# EAGLE board RBCX-MainBoard (EAGLE 9.6.0), part 1 of 3
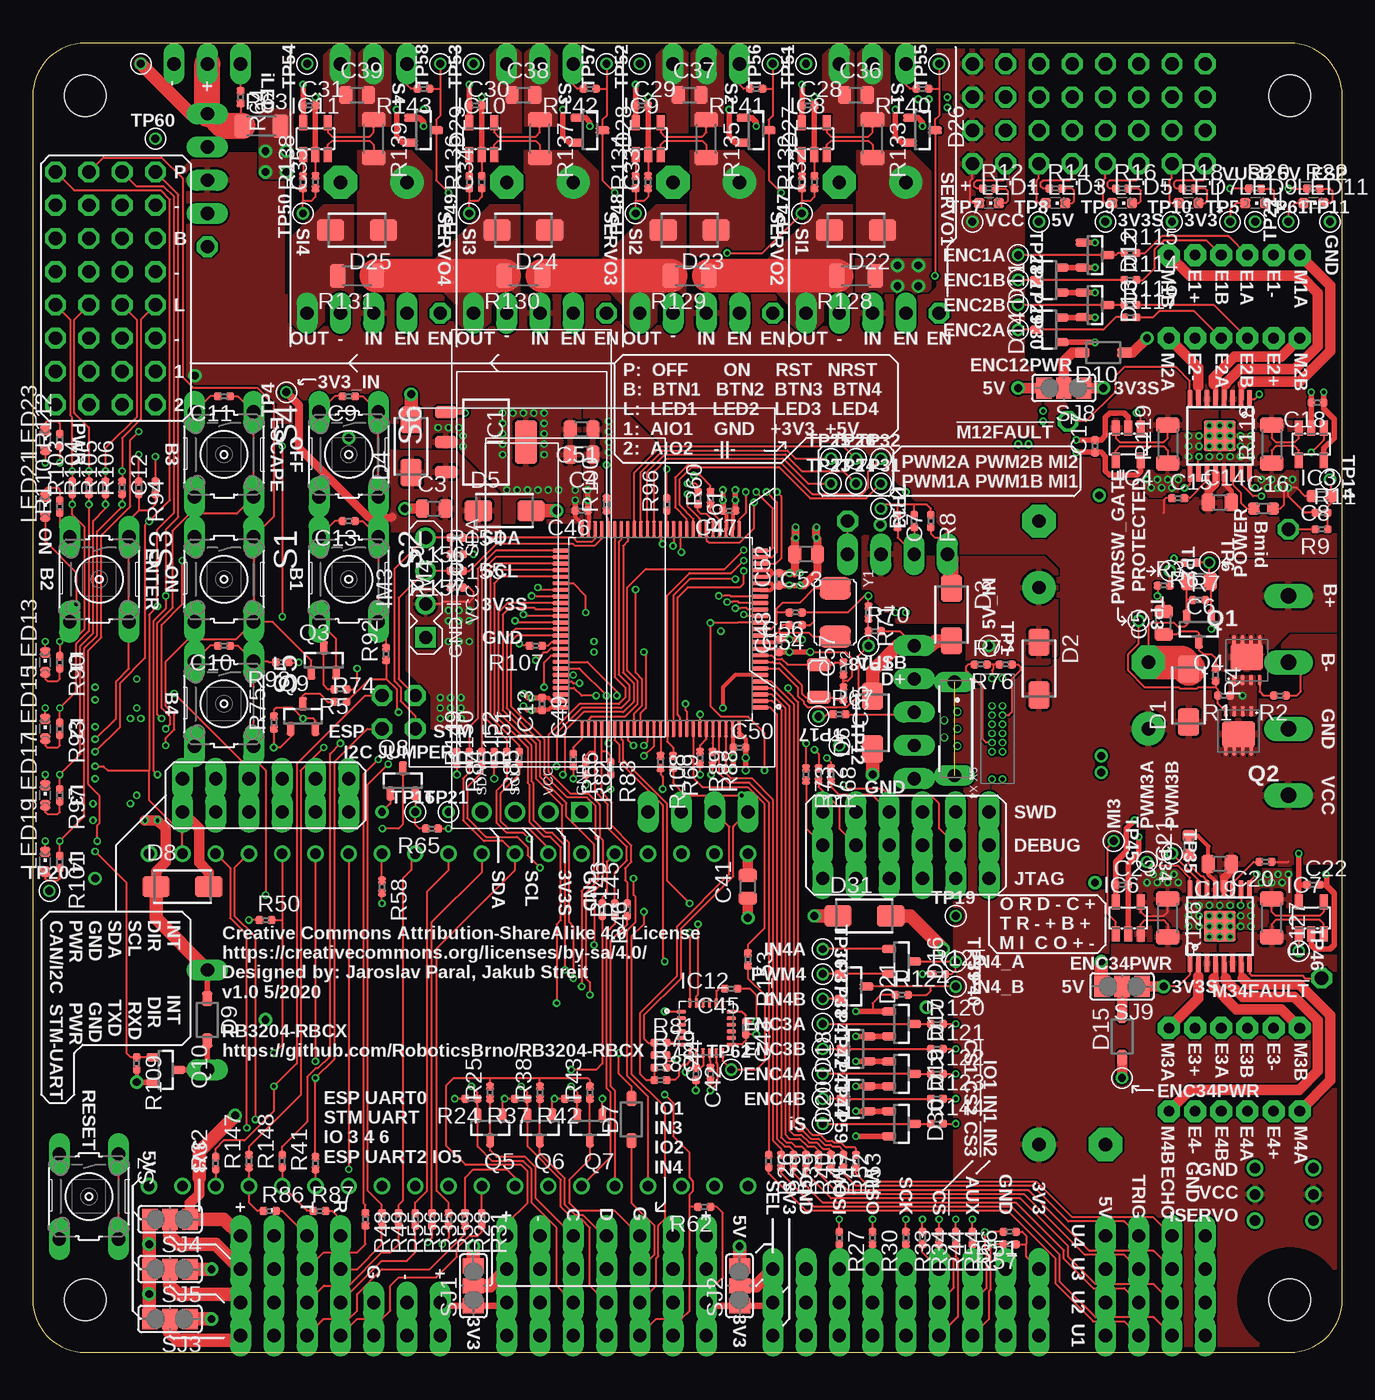
[diagram p14: board, top side]
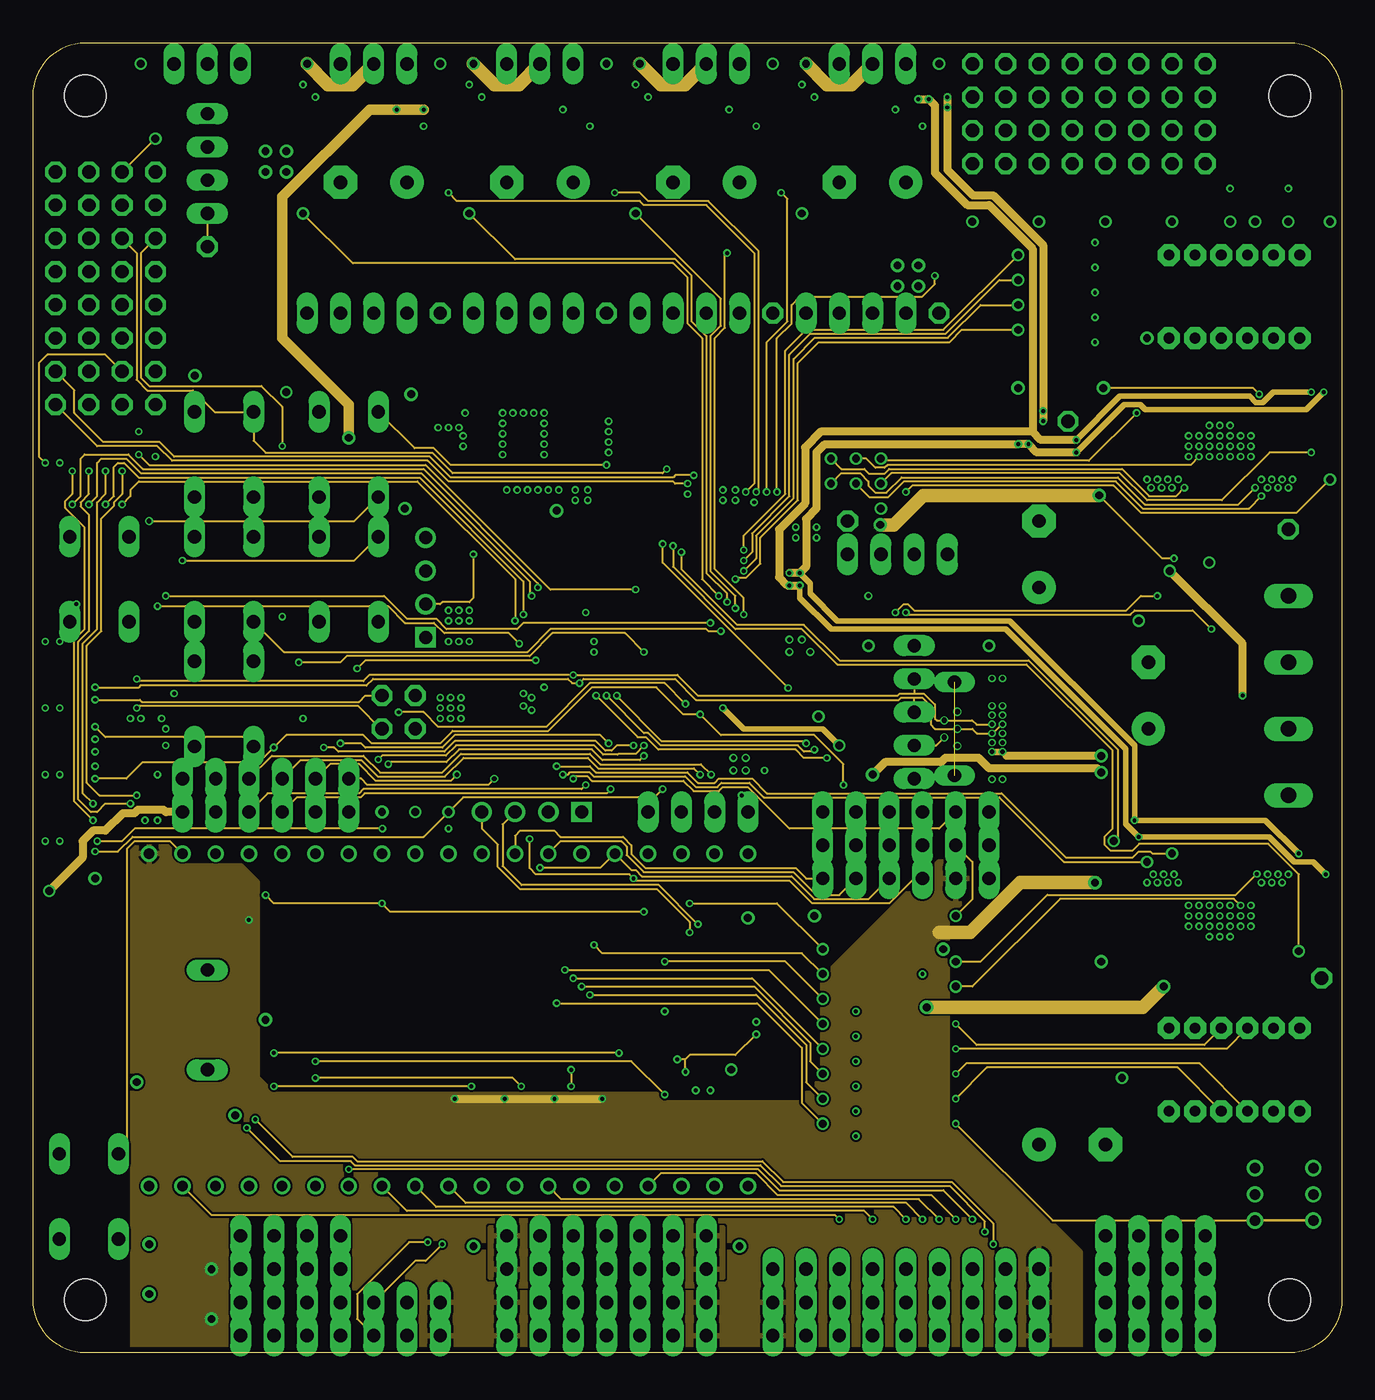
[diagram p15: board, inner layer Layer2-Sig]
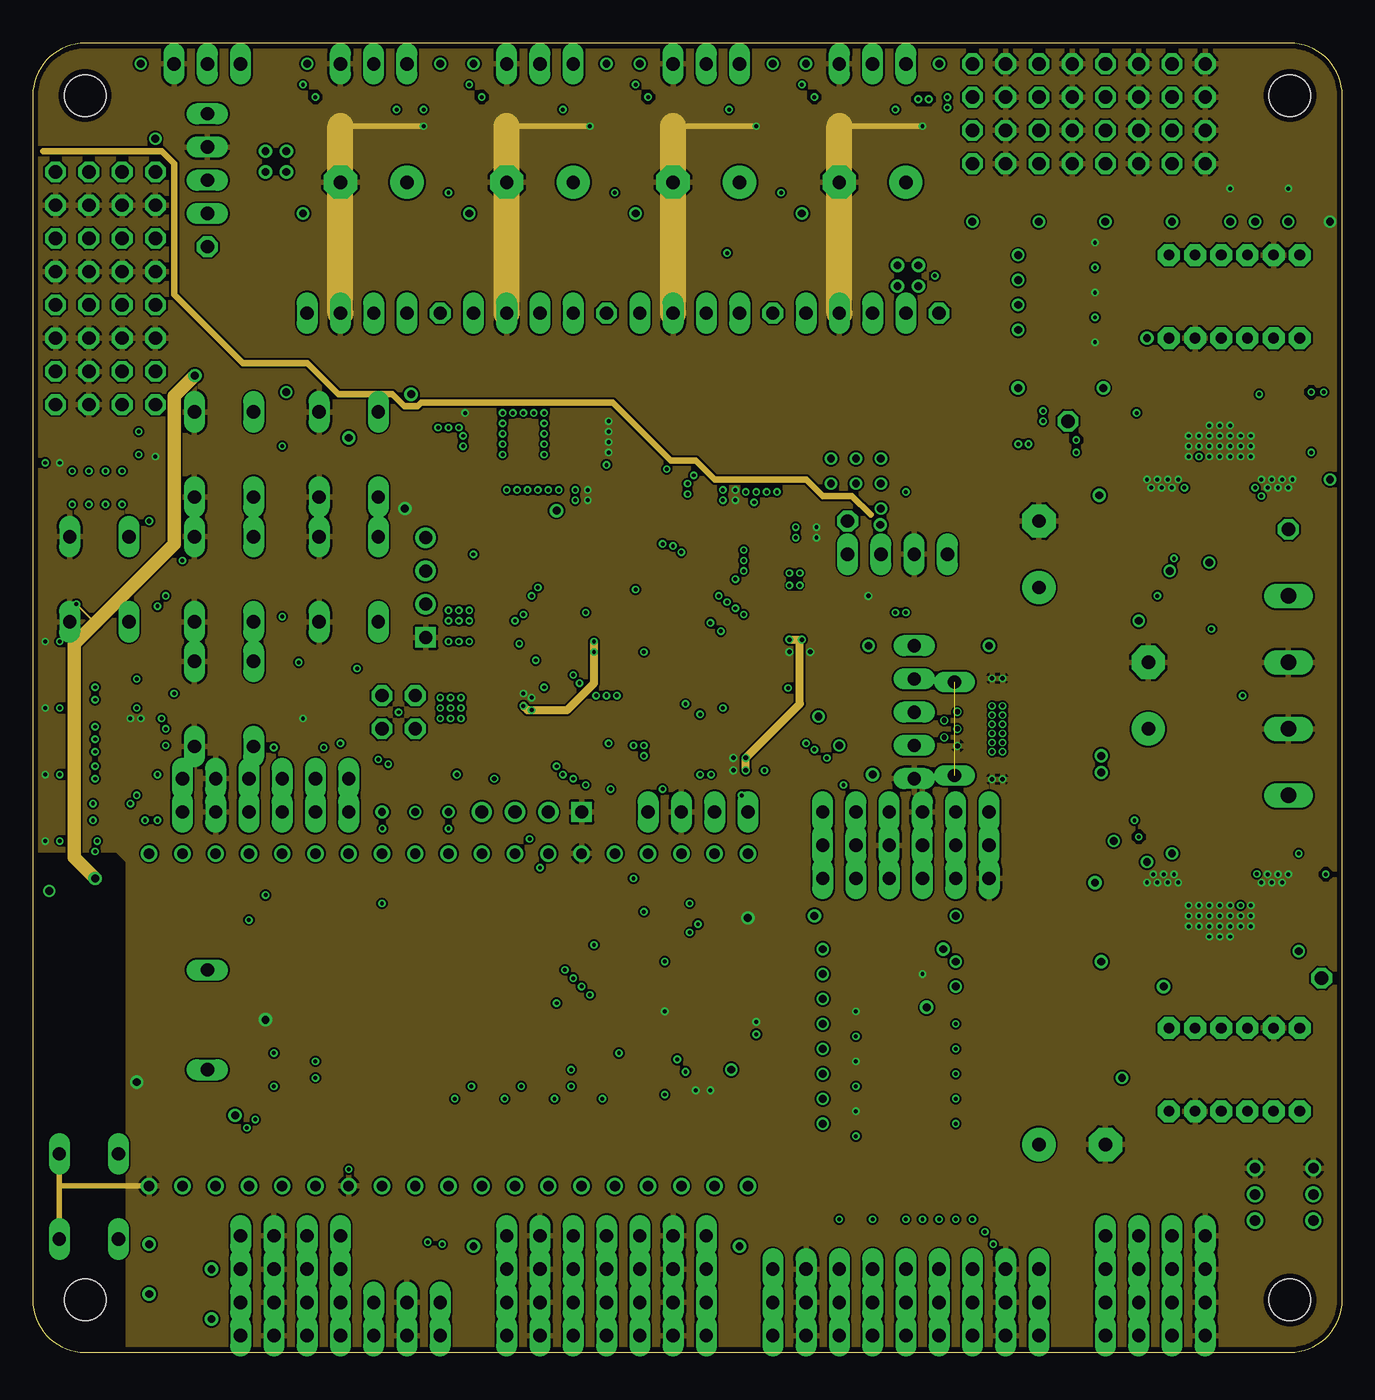
[diagram p16: board, inner layer Layer3-GND]
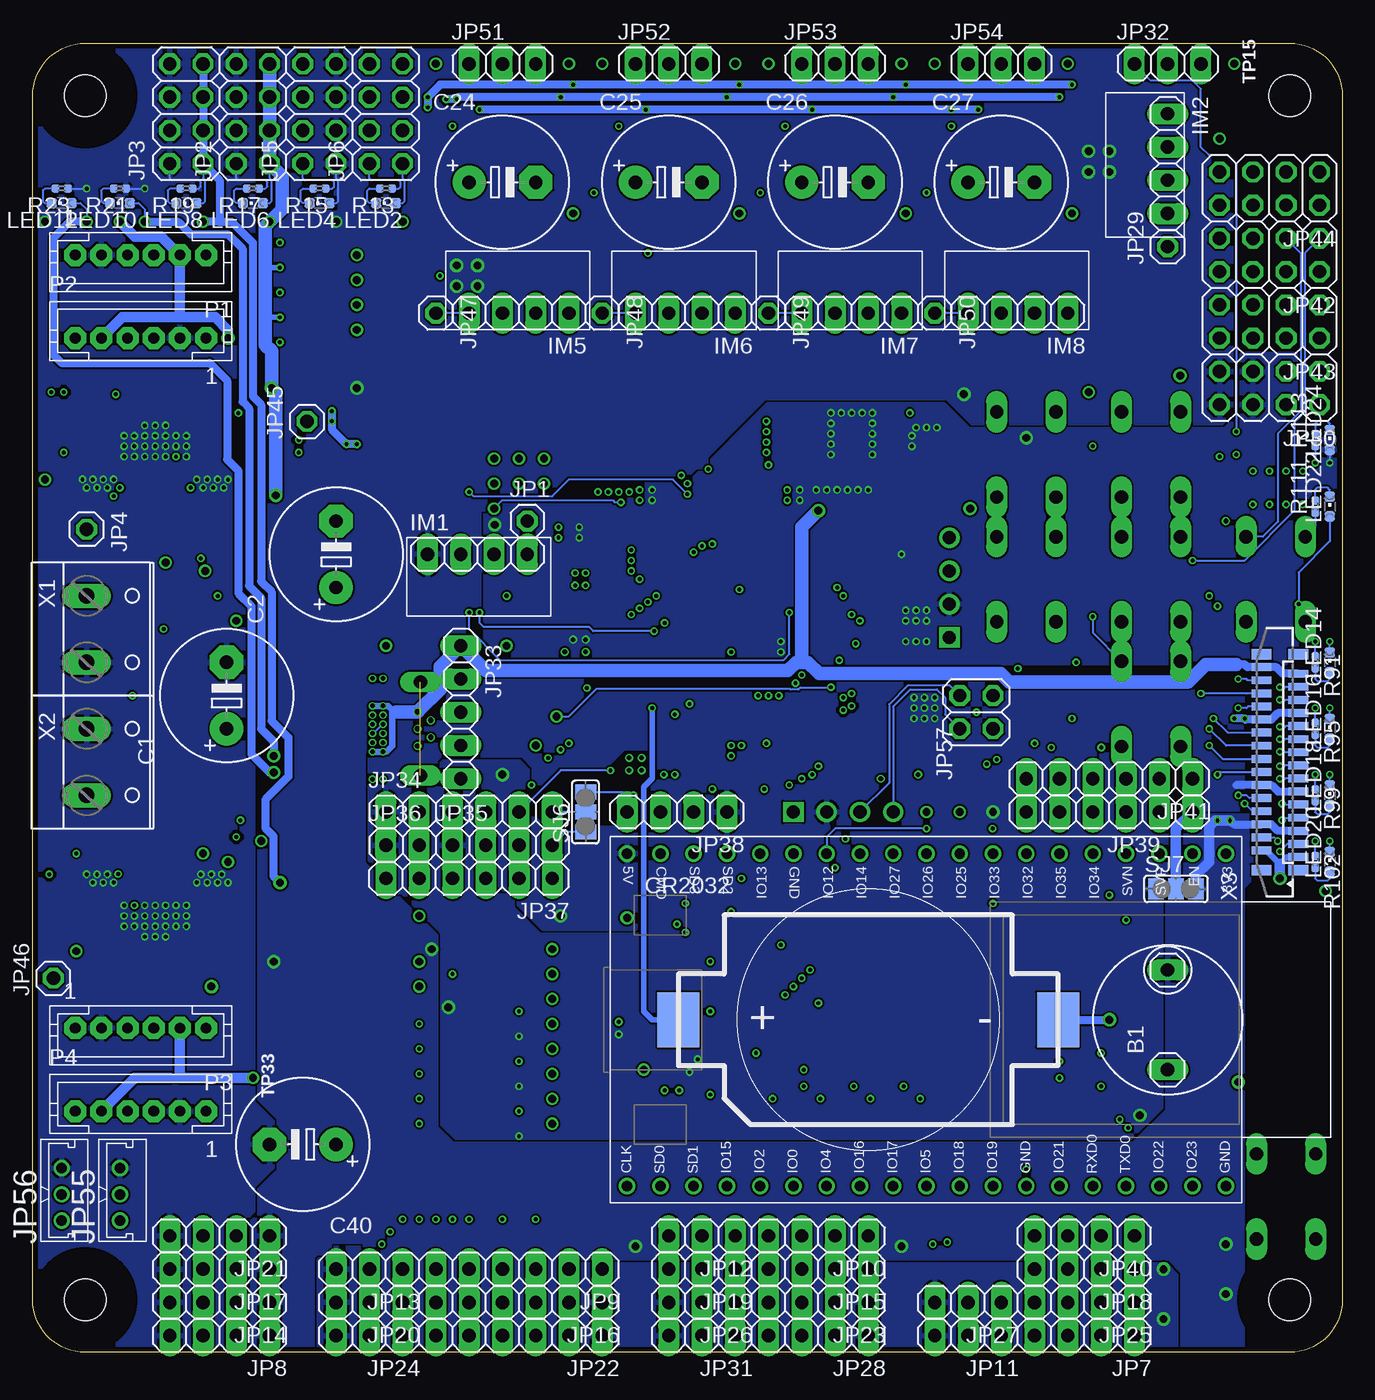
[diagram p17: board, bottom side, seen from below]

Size 100 x 100 mm. Coordinates in mm from the lower left corner, seen from the top.
Outline: 4,0 96,0 arc90 100,4 100,96 arc90 96,100 4,100 arc90 0,96 0,4 arc90 4,0
Copper layers (1+2*15+16): Top 0.035mm / dielectric 0.13mm / Layer2-Sig 0.018mm / dielectric 1.2mm / Layer3-GND 0.018mm / dielectric 0.13mm / Bottom 0.035mm
Design rules "robotikabrno-4-layers *": minimum track width 0.15mm, minimum drill 0.3mm, track to track 0.15mm, track to pad 0.15mm, pad to pad 0.15mm, via to via 0.15mm, smd to smd 0mil, copper to edge 0.4mm, drill to drill 0.35mm, minimum pad ring 3mil, minimum via ring 0.13mm, stop-mask expansion 0.1mm, vias tented up to drill 0.4mm, thermal gap 0.2mm
Net classes: 0 default: width 0.15 mm, drill 0.3 mm, clearance 0.15 mm
Holes 3.2 mm at 4,96 96,96 96,4 4,4
tRestrict: area 0,92 to 8,100; area 92,92 to 100,100; area 92,0 to 100,8; area 0,0 to 8,8; 9 lines
bRestrict: area 92,92 to 100,100; area 0,0 to 8,8; area 0,92 to 8,100; area 92,0 to 100,8

## Footprints (pad centres in the part's own frame; a part is rotated, then mirrored left to right if it is on the bottom)
PIEZO = drill 1.016 long: + 1.27,8.89; - 1.27,1.27
SMD-BAT-CR2032-BS-6-1 = smd 3.2 x 4.2: VBAT 14.5,0; VSS -14.5,0
E5-10,5 = drill 1.016 pad 2.54: + -2.54,0 | drill 1.016 pad 2.54 octagon: - 2.54,0
C0805 = smd 1.03 x 1.42: 1 -0.87,0; 2 0.87,0
C0402 = smd 0.6 x 0.58: 1 -0.465,0; 2 0.465,0
C0603 = smd 0.89 x 0.93: 1 -0.72,0; 2 0.72,0
SMA = smd 2.08 x 1.62: A 2.015,0; C -2.015,0
SOD123 = smd 1.15 x 0.8: A 1.61,0; C -1.61,0
SOT23 = smd 0.61 x 1.05: 1 -0.95,-0.96; 2 0.95,-0.96; 3 0,0.96
SOT223 = smd 0.99 x 1.69: 1 -2.29,-3.055; 2 0,-3.055; 3 2.29,-3.055 | smd 3.3 x 1.69: 4 0,3.055
HTSSOP = smd 0.39 x 1.37: 1 -2.275,-2.82; 2 -1.625,-2.82; 3 -0.975,-2.82; 4 -0.325,-2.82; 5 0.325,-2.82; 6 0.975,-2.82; 7 1.625,-2.82; 8 2.275,-2.82; 9 2.275,2.82; 10 1.625,2.82; 11 0.975,2.82; 12 0.325,2.82; 13 -0.325,2.82; 14 -0.975,2.82; 15 -1.625,2.82; 16 -2.275,2.82 | smd 2.46 x 2.31: GND 0,0
SOT23-5L = smd 0.61 x 1.16: 1 -0.95,-1.23; 2 0,-1.23; 3 0.95,-1.23; 4 0.95,1.23; 5 -0.95,1.23
QFN50P400X400X95-24N = smd 0.71 x 0.26: 1 -1.91,1.25; 2 -1.91,0.75; 3 -1.91,0.25; 4 -1.91,-0.25; 5 -1.91,-0.75; 6 -1.91,-1.25; 13 1.91,-1.25; 14 1.91,-0.75; 15 1.91,-0.25; 16 1.91,0.25; 17 1.91,0.75; 18 1.91,1.25 | smd 0.26 x 0.71: 7 -1.25,-1.91; 8 -0.75,-1.91; 9 -0.25,-1.91; 10 0.25,-1.91; 11 0.75,-1.91; 12 1.25,-1.91; 19 1.25,1.91; 20 0.75,1.91; 21 0.25,1.91; 22 -0.25,1.91; 23 -0.75,1.91; 24 -1.25,1.91
QFP50P1600X1600X160-100N_STM32F103VCT6 = smd 0.3 x 1.26: 1 -6,-7.63; 2 -5.5,-7.63; 3 -5,-7.63; 4 -4.5,-7.63; 5 -4,-7.63; 6 -3.5,-7.63; 7 -3,-7.63; 8 -2.5,-7.63; 9 -2,-7.63; 10 -1.5,-7.63; 11 -1,-7.63; 12 -0.5,-7.63; 13 0,-7.63; 14 0.5,-7.63; 15 1,-7.63; 16 1.5,-7.63; 17 2,-7.63; 18 2.5,-7.63; 19 3,-7.63; 20 3.5,-7.63; 21 4,-7.63; 22 4.5,-7.63; 23 5,-7.63; 24 5.5,-7.63; 25 6,-7.63; 51 6,7.63; 52 5.5,7.63; 53 5,7.63; 54 4.5,7.63; 55 4,7.63; 56 3.5,7.63; 57 3,7.63; 58 2.5,7.63; 59 2,7.63; 60 1.5,7.63; 61 1,7.63; 62 0.5,7.63; 63 0,7.63; 64 -0.5,7.63; 65 -1,7.63; 66 -1.5,7.63; 67 -2,7.63; 68 -2.5,7.63; 69 -3,7.63; 70 -3.5,7.63; 71 -4,7.63; 72 -4.5,7.63; 73 -5,7.63; 74 -5.5,7.63; 75 -6,7.63 | smd 1.26 x 0.3: 26 7.63,-6; 27 7.63,-5.5; 28 7.63,-5; 29 7.63,-4.5; 30 7.63,-4; 31 7.63,-3.5; 32 7.63,-3; 33 7.63,-2.5; 34 7.63,-2; 35 7.63,-1.5; 36 7.63,-1; 37 7.63,-0.5; 38 7.63,0; 39 7.63,0.5; 40 7.63,1; 41 7.63,1.5; 42 7.63,2; 43 7.63,2.5; 44 7.63,3; 45 7.63,3.5; 46 7.63,4; 47 7.63,4.5; 48 7.63,5; 49 7.63,5.5; 50 7.63,6; 76 -7.63,6; 77 -7.63,5.5; 78 -7.63,5; 79 -7.63,4.5; 80 -7.63,4; 81 -7.63,3.5; 82 -7.63,3; 83 -7.63,2.5; 84 -7.63,2; 85 -7.63,1.5; 86 -7.63,1; 87 -7.63,0.5; 88 -7.63,0; 89 -7.63,-0.5; 90 -7.63,-1; 91 -7.63,-1.5; 92 -7.63,-2; 93 -7.63,-2.5; 94 -7.63,-3; 95 -7.63,-3.5; 96 -7.63,-4; 97 -7.63,-4.5; 98 -7.63,-5; 99 -7.63,-5.5; 100 -7.63,-6
STEPDOWN = drill 1.016 long: EN 1.27,8.89; GND 1.27,3.81; IN 1.27,6.35; OUT 1.27,1.27
DISPLAY-OLED-128X64-I2C_W-HOLES = drill 1 square: 1 -3.81,12.7 | drill 1: 2 -1.27,12.7; 3 1.27,12.7; 4 3.81,12.7
DISPLAY-OLED-128X32 = drill 1 square: 1 -17.78,-3.81 | drill 1: 2 -17.78,-1.27; 3 -17.78,1.27; 4 -17.78,3.81
DEVKITC = drill 0.8: 1 -12.7,46.99; 2 -12.7,44.45; 3 -12.7,41.91; 4 -12.7,39.37; 5 -12.7,36.83; 6 -12.7,34.29; 7 -12.7,31.75; 8 -12.7,29.21; 9 -12.7,26.67; 10 -12.7,24.13; 11 -12.7,21.59; 12 -12.7,19.05; 13 -12.7,16.51; 14 -12.7,13.97; 15 -12.7,11.43; 16 -12.7,8.89; 17 -12.7,6.35; 18 -12.7,3.81; 19 -12.7,1.27; 20 12.7,1.27; 21 12.7,3.81; 22 12.7,6.35; 23 12.7,8.89; 24 12.7,11.43; 25 12.7,13.97; 26 12.7,16.51; 27 12.7,19.05; 28 12.7,21.59; 29 12.7,24.13; 30 12.7,26.67; 31 12.7,29.21; 32 12.7,31.75; 33 12.7,34.29; 34 12.7,36.83; 35 12.7,39.37; 36 12.7,41.91; 37 12.7,44.45; 38 12.7,46.99
1X01 = drill 1.016 octagon: 1 0,0
2X04 = drill 1.016 octagon: 1 -3.81,-1.27; 2 -3.81,1.27; 3 -1.27,-1.27; 4 -1.27,1.27; 5 1.27,-1.27; 6 1.27,1.27; 7 3.81,-1.27; 8 3.81,1.27
1X04 = drill 1.016 long: 1 -3.81,0; 2 -1.27,0; 3 1.27,0; 4 3.81,0
1X06 = drill 1.016 long: 1 -6.35,0; 2 -3.81,0; 3 -1.27,0; 4 1.27,0; 5 3.81,0; 6 6.35,0
1X03 = drill 1.016 long: 1 -2.54,0; 2 0,0; 3 2.54,0
1X05 = drill 1.016 long: 1 -5.08,0; 2 -2.54,0; 3 0,0; 4 2.54,0; 5 5.08,0
1X02 = drill 1.016 long: 1 -1.27,0; 2 1.27,0
292161-3 = drill 0.8: 1 -2,0; 2 0,0; 3 2,0
2X02 = drill 1.016 octagon: 1 -1.27,-1.27; 2 -1.27,1.27; 3 1.27,-1.27; 4 1.27,1.27
CHIPLED_0603 = smd 0.8 x 0.8: A 0,-0.75; C 0,0.75
JST-PH6 = drill 0.813 pad 1.676 octagon: 1 5,0; 2 3,0; 3 1,0; 4 -1,0; 5 -3,0; 6 -5,0
MLP3.3X3.3_HS = smd 0.32 x 0.76: 1 -0.975,-1.495; 2 -0.325,-1.495; 3 0.325,-1.495; 4 0.975,-1.495; 5 0.975,1.495; 6 0.325,1.495; 7 -0.325,1.495; 8 -0.975,1.495 | smd 2.5 x 2: 9 0,0.25
R0402 = smd 0.6 x 0.58: 1 -0.465,0; 2 0.465,0
R1206 = smd 1.2 x 1.82: 1 -1.46,0; 2 1.46,0
B3F-10XX = drill 1.016 long: 1 -3.251,2.261; 2 3.251,2.261; 3 -3.251,-2.261; 4 3.251,-2.261
SJ_2 = smd 1.168 x 1.6: 1 -1.524,0; 2 0,0; 3 1.524,0
TP_06 = drill 0.6: P$1 0,0
W237-132 = drill 1.194 long: 1 -2.54,-0.635; 2 2.54,-0.635
52559-3092 = smd 0.6 x 1.5: 1 -7.25,-1.4; 2 -6.75,1.4; 3 -6.25,-1.4; 4 -5.75,1.4; 5 -5.25,-1.4; 6 -4.75,1.4; 7 -4.25,-1.4; 8 -3.75,1.4; 9 -3.25,-1.4; 10 -2.75,1.4; 11 -2.25,-1.4; 12 -1.75,1.4; 13 -1.25,-1.4; 14 -0.75,1.4; 15 -0.25,-1.4; 16 0.25,1.4; 17 0.75,-1.4; 18 1.25,1.4; 19 1.75,-1.4; 20 2.25,1.4; 21 2.75,-1.4; 22 3.25,1.4; 23 3.75,-1.4; 24 4.25,1.4; 25 4.75,-1.4; 26 5.25,1.4; 27 5.75,-1.4; 28 6.25,1.4; 29 6.75,-1.4; 30 7.25,1.4 | smd 0.8 x 1.5: M1 -8.25,-1.4; M2 8.25,-1.4; M3 8.25,1.4; M4 -8.25,1.4
614105150621 = drill 0.4: 1 -1.3,0.125; 2 -0.65,-0.875; 3 0,0.125; 4 0.65,-0.875; 5 1.3,0.125 | drill 1 pad 1.4 long: S1 -3.575,-0.095; S2 3.575,-0.095
USB_C_VERT_THT_8PIN = drill 0.35 pad 0.55: A1 -3.85,0.4; A4 -1.75,0.4; A5 -1.05,0.4; A6 -0.35,0.4; A7 0.35,0.4; A8 1.05,0.4; A9 1.75,0.4; A12 3.85,0.4; B1 3.85,-0.4; B4 1.75,-0.4; B5 1.05,-0.4; B6 0.35,-0.4; B7 -0.35,-0.4; B8 -1.05,-0.4; B9 -1.75,-0.4; B12 -3.85,-0.4
OSCCC500X320X135 = smd 1.7 x 2.4: 1 -1.85,0; 2 1.85,0
SMD-3215_2P = smd 1 x 1.8: 1 -1.25,0; 2 1.25,0

## Placement (x,y rotation side)
B1  PIEZO  [PIEZO]  14.61,20.32 0 bottom
BAT1  CR2032  [SMD-BAT-CR2032-BS-6-1]  36.2,25.4 180 bottom
C1  220u  [E5-10,5]  85.19,50.16 90 bottom
C2  220u  [E5-10,5]  76.83,60.96 90 bottom
C3  10u  [C0805]  30.64,64.45 0 top
C4  10u  [C0805]  41.91,68.58 180 top
C5  10u  [C0805]  86.36,55.72 90 top
C6  10u  [C0805]  89.06,58.9 180 top
C7  1u  [C0402]  66.04,63.5 270 top
C8  2u2  [C0603]  98.42,65.41 180 top
C9  1u  [C0402]  24.13,73.03 180 top
C10  1u  [C0402]  14.61,53.98 180 top
C11  1u  [C0402]  14.61,73.03 180 top
C12  1u  [C0402]  9.37,66.04 90 top
C13  1u  [C0402]  24.13,63.5 180 top
C14  10u  [C0805]  90.65,64.93 0 top
C15  10n  [C0402]  87.47,65.25 0 top
C16  2u2  [C0603]  93.98,64.45 0 top
C17  100n  [C0402]  81.12,69.22 90 top
C18  100n  [C0402]  98.11,72.55 180 top
C19  10u  [C0805]  90.65,37.31 180 top
C20  10n  [C0402]  94.14,37.47 180 top
C21  2u2  [C0603]  88.27,38.73 90 top
C22  100n  [C0402]  97.79,35.72 0 top
C23  100n  [C0402]  83.19,35.72 0 top
C24  220u  [E5-10,5]  64.14,89.38 0 bottom
C25  220u  [E5-10,5]  51.44,89.38 0 bottom
C26  220u  [E5-10,5]  38.73,89.38 0 bottom
C27  220u  [E5-10,5]  26.04,89.38 0 bottom
C28  100n  [C0402]  59.21,95.25 0 top
C29  100n  [C0402]  46.51,95.25 0 top
C30  100n  [C0402]  33.81,95.25 0 top
C31  100n  [C0402]  21.11,95.25 0 top
C32  1u  [C0402]  59.69,89.38 90 top
C33  1u  [C0402]  46.99,89.38 90 top
C34  1u  [C0402]  34.29,89.38 90 top
C35  1u  [C0402]  21.59,89.38 90 top
C36  10u  [C0805]  62.87,96.04 0 top
C37  10u  [C0805]  50.16,96.04 0 top
C38  10u  [C0805]  37.47,96.04 0 top
C39  10u  [C0805]  24.77,96.04 0 top
C40  220u  [E5-10,5]  79.38,15.88 180 bottom
C41  10u  [C0805]  54.61,35.56 90 top
C42  10n  [C0402]  50.64,21.27 270 top
C43  100n  [C0402]  54.45,24.77 270 top
C44  100n  [C0402]  51.75,21.27 90 top
C45  2n2  [C0402]  53.34,27.78 180 top
C46  100n  [C0402]  41.91,64.29 180 top
C47  100n  [C0402]  53.18,64.29 180 top
C48  100n  [C0402]  56.99,53.98 90 top
C49  100n  [C0402]  38.89,49.53 270 top
C50  100n  [C0402]  53.98,46.2 0 top
C51  10u  [C0805]  41.91,70.48 180 top
C52  100n  [C0402]  56.99,59.05 90 top
C53  10u  [C0805]  59.05,60.96 180 top
C54  18p  [C0402]  58.26,55.56 180 top
C55  6.8p  [C0402]  61.91,50.32 270 top
C56  18p  [C0402]  58.26,56.52 180 top
C57  6.8p  [C0402]  61.91,52.23 90 top
D1  SS34  [SMA]  88.27,50.16 90 top
D2  SS34  [SMA]  76.83,52.23 270 top
D3  SS34  [SMA]  70.17,56.36 270 top
D4  SS34  [SMA]  28.89,69.22 90 top
D5  SS34  [SMA]  36.04,64.29 0 top
D6  SS34  [SMA]  64.14,48.1 90 top
D7  B5819W  [SOD123]  45.72,17.78 90 top
D8  SS34  [SMA]  11.43,35.56 0 top
D9  B5819W  [SOD123]  13.34,25.4 270 top
D10  B5819W  [SOD123]  81.76,76.36 180 top
D11  BAS40-04  [SOT23]  77.63,81.92 90 top
D12  BAS40-04  [SOT23]  81.12,83.82 270 top
D13  BAS40-04  [SOT23]  81.12,80.01 270 top
D14  BAS40-04  [SOT23]  77.63,78.11 90 top
D15  B5819W  [SOD123]  83.19,24.13 90 top
D16  BAS40-05  [SOT23]  66.36,29.84 270 top
D17  BAS40-04  [SOT23]  66.36,25.08 270 top
D18  BAS40-04  [SOT23]  62.87,23.18 90 top
D19  BAS40-04  [SOT23]  66.36,21.27 270 top
D20  BAS40-04  [SOT23]  62.87,19.37 90 top
D21  BAS40-05  [SOT23]  62.71,27.94 270 top
D22  SS34  [SMA]  62.87,85.72 180 top
D23  SS34  [SMA]  50.16,85.72 180 top
D24  SS34  [SMA]  37.47,85.72 180 top
D25  SS34  [SMA]  24.77,85.72 180 top
D26  BAS40-04  [SOT23]  67.94,93.34 270 top
D27  BAS40-04  [SOT23]  55.24,93.34 270 top
D28  BAS40-04  [SOT23]  42.55,93.34 270 top
D29  BAS40-04  [SOT23]  29.84,93.34 270 top
D30  BAS40-04  [SOT23]  66.36,17.46 270 top
D31  SS34  [SMA]  63.5,33.34 0 top
IC1  AMS1117-3.3  [SOT223]  34.61,69.53 270 top
IC2  DRV8833PWP  [HTSSOP]  90.65,70.01 180 top
IC3  INA180A4  [SOT23-5L]  97.63,69.37 180 top
IC4  INA180A4  [SOT23-5L]  83.66,69.37 180 top
IC5  DRV8833PWP  [HTSSOP]  90.65,32.54 0 top
IC6  INA180A4  [SOT23-5L]  83.66,33.18 0 top
IC7  INA180A4  [SOT23-5L]  97.63,33.18 0 top
IC8  INA180A4  [SOT23-5L]  59.69,92.71 0 top
IC9  INA180A4  [SOT23-5L]  46.99,92.71 0 top
IC10  INA180A4  [SOT23-5L]  34.29,92.71 0 top
IC11  INA180A4  [SOT23-5L]  21.59,92.71 0 top
IC12  MPU-6050  [QFN50P400X400X95-24N]  51.44,24.77 0 top
IC13  STM32F103VCT6  [QFP50P1600X1600X160-100N_STM32F103VCT6]  47.94,55.24 90 top
IM1  STEPDOWN  [STEPDOWN]  71.12,62.23 270 bottom
IM2  STEPDOWN  [STEPDOWN]  12.06,95.89 180 bottom
IM3  DISPLAY-OLED-128X64-I2C-W_HOLES  [DISPLAY-OLED-128X64-I2C_W-HOLES]  42.7,58.42 90 top
IM4  DISPLAY-OLED-128X32  [DISPLAY-OLED-128X32]  38.1,59.05 90 top
IM5  STEPDOWN  [STEPDOWN]  57.78,78.11 90 bottom
IM6  STEPDOWN  [STEPDOWN]  45.09,78.11 90 bottom
IM7  STEPDOWN  [STEPDOWN]  32.38,78.11 90 bottom
IM8  STEPDOWN  [STEPDOWN]  19.68,78.11 90 bottom
IM9  DEVKITC  [DEVKITC]  55.88,25.4 270 bottom
JP1  IM1_EN  [1X01]  62.23,63.5 0 bottom
JP2  +3V3STM  [2X04]  83.19,94.61 90 bottom
JP3  +3V3  [2X04]  88.27,94.61 90 bottom
JP4  VBAT/2  [1X01]  95.89,62.87 270 bottom
JP5  +5V  [2X04]  78.11,94.61 90 bottom
JP6  VCC  [2X04]  73.03,94.61 90 bottom
JP7  ESP_UART  [1X04]  19.68,1.27 180 bottom
JP8  UTS1  [1X04]  85.72,1.27 180 bottom
JP9  ESP_SPI1  [1X06]  62.87,6.35 180 bottom
JP10  ESP_I2C1_5V  [1X04]  40.01,8.89 180 bottom
JP11  ESP_UART_AUX  [1X03]  28.57,1.27 180 bottom
JP12  ESP_I2C_AUX1_5V  [1X03]  48.9,8.89 180 bottom
JP13  ESP_SPI_AUX1  [1X03]  74.3,6.35 180 bottom
JP14  UTS2  [1X04]  85.72,3.81 180 bottom
JP15  ESP_I2C2_5V  [1X04]  40.01,6.35 180 bottom
JP16  ESP_SPI2  [1X06]  62.87,3.81 180 bottom
JP17  UTS3  [1X04]  85.72,6.35 180 bottom
JP18  STM_UART  [1X04]  19.68,6.35 180 bottom
JP19  ESP_I2C_AUX2_5V  [1X03]  48.9,6.35 180 bottom
JP20  ESP_SPI_AUX2  [1X03]  74.3,3.81 180 bottom
JP21  UTS4  [1X04]  85.72,8.89 180 bottom
JP22  ESP_SPI3  [1X06]  62.87,1.27 180 bottom
JP23  ESP_I2C1  [1X04]  40.01,3.81 180 bottom
JP24  ESP_SPI_AUX3  [1X03]  74.3,1.27 180 bottom
JP25  ESP_UCOM  [1X04]  19.68,3.81 180 bottom
JP26  ESP_I2C_AUX1  [1X03]  48.9,3.81 180 bottom
JP27  ESP_UCOM_AUX  [1X03]  28.57,3.81 180 bottom
JP28  ESP_I2C2  [1X04]  40.01,1.27 180 bottom
JP29  IM9_EN  [1X01]  13.34,84.45 90 bottom
JP30  AIO  [2X04]  5.56,73.66 180 bottom
JP31  ESP_I2C_AUX2  [1X03]  48.9,1.27 180 bottom
JP32  ILED  [1X03]  13.34,98.42 0 bottom
JP33  USB  [1X05]  67.31,48.9 270 bottom
JP34  SWD  [1X06]  66.67,41.27 0 bottom
JP35  DEBUG  [1X04]  64.14,38.73 0 bottom
JP36  BOOT_SW  [1X02]  71.75,38.73 0 bottom
JP37  ESP32_JTAG  [1X06]  66.67,36.2 180 bottom
JP38  MPU_I2C  [1X04]  50.8,41.27 180 bottom
JP39  EXPANDER_UART  [1X06]  17.78,41.27 180 bottom
JP40  ESP_PROG_UART  [1X04]  19.68,8.89 180 bottom
JP41  EXPANDER_CAN/I2C  [1X06]  17.78,43.81 180 bottom
JP42  BUTTONS  [2X04]  5.56,83.82 180 bottom
JP43  LEDS  [2X04]  5.56,78.74 180 bottom
JP44  PWR_BUTTONS  [2X04]  5.56,88.9 180 bottom
JP45  M12FAULT  [1X01]  79.06,71.12 90 bottom
JP46  M34FAULT  [1X01]  98.42,28.57 90 bottom
JP47  SERVO1_EN  [1X01]  69.22,79.38 270 bottom
JP48  SERVO2_EN  [1X01]  56.52,79.38 270 bottom
JP49  SERVO3_EN  [1X01]  43.81,79.38 270 bottom
JP50  SERVO4_EN  [1X01]  31.11,79.38 270 bottom
JP51  SERVO1  [1X03]  64.14,98.42 0 bottom
JP52  SERVO2  [1X03]  51.44,98.42 0 bottom
JP53  SERVO3  [1X03]  38.73,98.42 0 bottom
JP54  SERVO4  [1X03]  26.04,98.42 0 bottom
JP55  INTELIGENT_SERVO1  [292161-3]  93.34,12.06 90 bottom
JP56  INTELIGENT_SERVO2  [292161-3]  97.79,12.06 90 bottom
JP57  I2C_INTERCONNECT  [2X02]  27.94,48.9 90 bottom
LED1  red  [CHIPLED_0603]  73.03,87.79 270 top
LED2  red  [CHIPLED_0603]  73.03,87.79 90 bottom
LED3  red  [CHIPLED_0603]  78.11,87.79 270 top
LED4  red  [CHIPLED_0603]  78.11,87.79 90 bottom
LED5  red  [CHIPLED_0603]  83.19,87.79 270 top
LED6  red  [CHIPLED_0603]  83.19,87.79 90 bottom
LED7  red  [CHIPLED_0603]  88.27,87.79 270 top
LED8  red  [CHIPLED_0603]  88.27,87.79 90 bottom
LED9  red  [CHIPLED_0603]  93.34,87.79 270 top
LED10  red  [CHIPLED_0603]  93.34,87.79 90 bottom
LED11  red  [CHIPLED_0603]  97.79,87.79 270 top
LED12  red  [CHIPLED_0603]  97.79,87.79 90 bottom
LED13  green  [CHIPLED_0603]  0.95,52.7 0 top
LED14  green  [CHIPLED_0603]  0.95,52.7 0 bottom
LED15  yellow  [CHIPLED_0603]  0.95,47.62 0 top
LED16  yellow  [CHIPLED_0603]  0.95,47.62 0 bottom
LED17  red  [CHIPLED_0603]  0.95,42.55 0 top
LED18  red  [CHIPLED_0603]  0.95,42.55 0 bottom
LED19  blue  [CHIPLED_0603]  0.95,37.47 0 top
LED20  blue  [CHIPLED_0603]  0.95,37.47 0 bottom
LED21  red  [CHIPLED_0603]  0.95,64.61 0 top
LED22  red  [CHIPLED_0603]  0.95,64.61 0 bottom
LED23  red  [CHIPLED_0603]  0.95,69.69 0 top
LED24  red  [CHIPLED_0603]  0.95,69.69 0 bottom
P1  M1  [JST-PH6]  91.76,83.82 180 bottom
P2  M2  [JST-PH6]  91.76,77.47 0 bottom
P3  M3  [JST-PH6]  91.76,24.77 180 bottom
P4  M4  [JST-PH6]  91.76,18.41 0 bottom
Q1  NCE20P45Q  [MLP3.3X3.3_HS]  92.71,52.86 0 top
Q2  NCE20P45Q  [MLP3.3X3.3_HS]  92.08,47.47 180 top
Q3  2N7002  [SOT23]  22.23,52.86 0 top
Q4  2N7002  [SOT23]  89.06,55.24 180 top
Q5  2N7002  [SOT23]  34.92,17.14 180 top
Q6  2N7002  [SOT23]  38.73,17.14 180 top
Q7  2N7002  [SOT23]  42.55,17.14 180 top
Q8  2N7002  [SOT23]  28.26,43.66 0 top
Q9  2N7002  [SOT23]  20.64,48.58 0 top
Q10  2N7002  [SOT23]  10.16,21.59 270 top
R1  100k  [R0402]  90.96,50.16 180 top
R2  10k  [R0402]  95.25,50.16 180 top
R3  24k  [R0402]  86.36,58.58 0 top
R4  10k  [R0402]  90.33,51.75 270 top
R5  330R  [R0402]  23.5,50.64 180 top
R6  10k  [R0402]  88.42,60.33 180 top
R7  1M  [R0402]  89.06,57.47 0 top
R8  24k  [R0402]  68.58,63.5 270 top
R9  5k6  [R0402]  98.42,62.87 180 top
R10  10k  [R0402]  67.31,63.5 90 top
R11  10k  [R0402]  98.42,64.14 0 top
R12  4k7  [R0402]  73.03,88.9 0 top
R13  4k7  [R0402]  73.03,88.9 180 bottom
R14  2k2  [R0402]  78.11,88.9 0 top
R15  2k2  [R0402]  78.11,88.9 180 bottom
R16  1k  [R0402]  83.19,88.9 0 top
R17  1k  [R0402]  83.19,88.9 180 bottom
R18  1k  [R0402]  88.27,88.9 0 top
R19  1k  [R0402]  88.27,88.9 180 bottom
R20  1k  [R0402]  93.34,88.9 0 top
R21  1k  [R0402]  93.34,88.9 180 bottom
R22  1k  [R0402]  97.79,88.9 0 top
R23  1k  [R0402]  97.79,88.9 180 bottom
R24  4k7  [R0402]  33.5,19.37 180 top
R25  4k7  [R0402]  34.92,19.84 90 top
R26  330R  [R0402]  56.2,14.61 270 top
R27  330R  [R0402]  61.59,8.73 270 top
R28  330R  [R0402]  33.02,10.16 270 top
R29  330R  [R0402]  57.15,14.61 270 top
R30  330R  [R0402]  64.14,8.73 270 top
R31  330R  [R0402]  34.29,10.16 270 top
R32  330R  [R0402]  13.97,14.45 90 top
R33  330R  [R0402]  66.67,8.73 270 top
R34  330R  [R0402]  67.94,8.73 270 top
R35  330R  [R0402]  30.48,10.16 270 top
R36  330R  [R0402]  71.75,8.73 270 top
R37  4k7  [R0402]  37.31,19.37 180 top
R38  4k7  [R0402]  38.73,19.84 90 top
R39  330R  [R0402]  58.1,14.61 270 top
R40  330R  [R0402]  59.05,14.61 270 top
R41  330R  [R0402]  21.59,14.45 90 top
R42  4k7  [R0402]  41.12,19.37 180 top
R43  4k7  [R0402]  42.55,19.84 90 top
R44  330R  [R0402]  69.22,8.73 270 top
R45  330R  [R0402]  60.01,14.61 270 top
R46  330R  [R0402]  43.5,33.81 270 top
R47  330R  [R0402]  60.96,14.61 270 top
R48  330R  [R0402]  25.4,10.16 270 top
R49  330R  [R0402]  26.67,10.16 270 top
R50  4k7  [R0402]  17.78,33.02 0 top
R51  100k  [R0402]  74.61,9.21 180 top
R52  330R  [R0402]  61.91,14.61 270 top
R53  330R  [R0402]  62.87,14.61 270 top
R54  330R  [R0402]  70.48,8.73 270 top
R55  330R  [R0402]  27.94,10.16 270 top
R56  330R  [R0402]  29.21,10.16 270 top
R57  100k  [R0402]  74.61,8.26 180 top
R58  330R  [R0402]  26.67,35.56 270 top
R59  330R  [R0402]  31.75,10.16 270 top
R60  330R  [R0402]  51.75,65.25 90 top
R61  330R  [R0402]  50.8,65.25 270 top
R62  4k7  [R0402]  51.28,11.11 180 top
R63  0R  [R1206]  17.46,93.66 0 top
R64  4k7  [R0402]  15.88,95.89 270 top
R65  330R  [R0402]  30.48,40.01 180 top
R66  330R  [R0402]  41.27,45.24 270 top
R67  1k5  [R0402]  61.59,48.74 0 top
R68  330R  [R0402]  60.96,44.13 270 top
R69  330R  [R0402]  48.9,45.09 270 top
R70  5k6  [R0402]  64.29,55.09 0 top
R71  10k  [R0402]  63.82,56.52 270 top
R72  330R  [R0402]  60.01,44.13 270 top
R73  330R  [R0402]  59.05,44.13 270 top
R74  100k  [R0402]  23.5,49.69 0 top
R75  100k  [R0402]  18.41,48.1 90 top
R76  1k  [R0402]  74.3,52.55 180 top
R77  1k  [R0402]  72.39,52.55 0 top
R78  4k7  [R0402]  47.94,21.75 0 top
R79  4k7  [R0402]  47.94,22.7 0 top
R80  330R  [R0402]  47.94,20.8 0 top
R81  330R  [R0402]  47.94,23.65 0 top
R82  330R  [R0402]  42.23,44.61 270 top
R83  330R  [R0402]  44.13,44.61 270 top
R84  330R  [R0402]  32.38,45.4 270 top
R85  330R  [R0402]  35.24,45.4 270 top
R86  330R  [R0402]  18.1,10.79 0 top
R87  330R  [R0402]  21.91,10.79 0 top
R88  330R  [R0402]  51.91,45.4 270 top
R89  330R  [R0402]  50.96,45.4 270 top
R90  330R  [R0402]  2.06,52.7 270 top
R91  330R  [R0402]  2.06,52.7 270 bottom
R92  330R  [R0402]  26.99,53.34 90 top
R93  330R  [R0402]  2.06,47.62 270 top
R94  330R  [R0402]  8.1,66.04 270 top
R95  330R  [R0402]  2.06,47.62 270 bottom
R96  330R  [R0402]  48.42,64.77 90 top
R97  330R  [R0402]  2.06,42.55 270 top
R98  330R  [R0402]  19.05,52.7 180 top
R99  330R  [R0402]  2.06,42.55 270 bottom
R100  330R  [R0402]  43.81,64.77 90 top
R101  330R  [R0402]  2.06,37.47 270 top
R102  330R  [R0402]  2.06,37.47 270 bottom
R103  330R  [R0402]  3.02,66.04 90 top
R104  330R  [R0402]  4.29,66.04 90 top
R105  330R  [R0402]  5.56,66.04 90 top
R106  330R  [R0402]  6.83,66.04 90 top
R107  330R  [R0402]  38.42,53.98 180 top
R108  330R  [R0402]  47.94,45.09 270 top
R109  100k  [R0402]  7.94,22.07 270 top
R110  4k7  [R0402]  2.06,64.61 90 top
R111  4k7  [R0402]  2.06,64.61 90 bottom
R112  1k  [R0402]  2.06,69.69 90 top
R113  1k  [R0402]  2.06,69.69 90 bottom
R114  2k2  [R0402]  83.82,81.92 0 top
R115  2k2  [R0402]  83.82,83.98 0 top
R116  2k2  [R0402]  83.82,80.01 0 top
R117  2k2  [R0402]  83.82,79.06 0 top
R118  5m  [R1206]  94.61,69.37 90 top
R119  5m  [R1206]  86.68,69.37 90 top
R120  2k2  [R0402]  69.06,25.08 0 top
R121  2k2  [R0402]  69.06,23.18 0 top
R122  2k2  [R0402]  69.06,21.27 0 top
R123  2k2  [R0402]  69.06,19.37 0 top
R124  10k  [R0402]  66.36,27.3 0 top
R125  10k  [R0402]  69.22,28.89 0 top
R126  5m  [R1206]  86.68,33.18 270 top
R127  5m  [R1206]  94.61,33.18 270 top
R128  0R  [R1206]  62.87,82.23 180 top
R129  0R  [R1206]  50.16,82.23 180 top
R130  0R  [R1206]  37.47,82.23 180 top
R131  0R  [R1206]  24.77,82.23 180 top
R132  1k  [R0402]  58.74,89.38 90 top
R133  5m  [R1206]  64.14,92.71 270 top
R134  1k  [R0402]  46.04,89.38 90 top
R135  5m  [R1206]  51.44,92.71 270 top
R136  1k  [R0402]  33.34,89.38 90 top
R137  5m  [R1206]  38.73,92.71 270 top
R138  1k  [R0402]  20.64,89.38 90 top
R139  5m  [R1206]  26.04,92.71 270 top
R140  2k2  [R0402]  67.94,96.52 180 top
R141  2k2  [R0402]  55.24,96.52 180 top
R142  2k2  [R0402]  42.55,96.52 180 top
R143  2k2  [R0402]  29.84,96.52 180 top
R144  2k2  [R0402]  69.06,17.46 0 top
R145  330R  [R0402]  45.4,33.81 90 top
R146  330R  [R0402]  44.45,33.81 90 top
R147  330R  [R0402]  16.51,14.61 90 top
R148  330R  [R0402]  19.05,14.61 90 top
R149  330R  [R0402]  33.34,45.4 90 top
R150  330R  [R0402]  34.29,45.4 90 top
R151  330R  [R0402]  37.15,45.4 90 top
R152  330R  [R0402]  36.2,45.4 90 top
R153  330R  [R0402]  54.61,30 270 top
R154  4k7  [R0402]  32.38,60.96 0 top
R155  4k7  [R0402]  32.38,58.42 0 top
R156  330R  [R0402]  32.38,62.23 180 top
R157  330R  [R0402]  32.38,59.69 180 top
S1  CHOOSE_ME  [B3F-10XX]  14.61,59.05 270 top
S2  CHOOSE_ME  [B3F-10XX]  24.13,59.05 270 top
S3  CHOOSE_ME  [B3F-10XX]  5.08,59.05 270 top
S4  CHOOSE_ME  [B3F-10XX]  14.61,68.58 270 top
S5  CHOOSE_ME  [B3F-10XX]  14.61,49.53 270 top
S6  CHOOSE_ME  [B3F-10XX]  24.13,68.58 270 top
S7  CHOOSE_ME  [B3F-10XX]  4.29,11.91 270 top
SJ1  [SJ_2]  33.66,5.08 90 top
SJ2  [SJ_2]  53.98,5.08 90 top
SJ3  [SJ_2]  10.48,2.54 180 top
SJ4  [SJ_2]  10.48,10.16 180 top
SJ5  [SJ_2]  10.48,6.35 180 top
SJ6  [SJ_2]  57.78,41.27 90 bottom
SJ7  [SJ_2]  12.7,35.4 0 bottom
SJ8  [SJ_2]  78.74,73.66 180 top
SJ9  [SJ_2]  83.19,27.94 180 top
TP1  [TP_06]  73.03,53.98 270 top
TP2  [TP_06]  86.84,59.69 270 top
TP3  [TP_06]  84.45,55.88 270 top
TP4  [TP_06]  19.37,73.34 90 top
TP5  [TP_06]  91.44,86.36 0 top
TP6  [TP_06]  89.85,60.33 270 top
TP7  [TP_06]  71.75,86.36 0 top
TP8  [TP_06]  76.83,86.36 0 top
TP9  [TP_06]  81.92,86.36 0 top
TP10  [TP_06]  87,86.36 0 top
TP11  [TP_06]  99.06,86.36 0 top
TP12  [TP_06]  61.59,46.35 270 top
TP13  [TP_06]  64.77,64.45 270 top
TP14  [TP_06]  99.06,66.67 270 top
TP15  [TP_06]  8.26,98.42 270 bottom
TP16  [TP_06]  29.21,41.27 0 top
TP17  [TP_06]  60.01,48.58 180 top
TP18  [TP_06]  63.82,53.98 180 top
TP19  [TP_06]  70.48,33.34 0 top
TP20  [TP_06]  1.27,35.24 0 top
TP21  [TP_06]  31.75,41.27 0 top
TP22  [TP_06]  93.34,86.36 270 top
TP23  [TP_06]  60.96,66.36 0 top
TP24  [TP_06]  62.87,66.36 0 top
TP25  [TP_06]  60.96,68.26 0 top
TP26  [TP_06]  62.87,68.26 0 top
TP27  [TP_06]  75.25,81.92 270 top
TP28  [TP_06]  75.25,83.82 270 top
TP29  [TP_06]  75.25,80.01 270 top
TP30  [TP_06]  75.25,78.11 270 top
TP31  [TP_06]  64.77,66.36 0 top
TP32  [TP_06]  64.77,68.26 0 top
TP33  [TP_06]  83.19,20.95 270 bottom
TP34  [TP_06]  85.09,37.47 270 top
TP35  [TP_06]  87,38.1 270 top
TP36  [TP_06]  60.33,30.8 270 top
TP37  [TP_06]  60.33,28.89 270 top
TP38  [TP_06]  60.33,26.99 270 top
TP39  [TP_06]  70.48,29.84 270 top
TP40  [TP_06]  70.48,27.94 270 top
TP41  [TP_06]  60.33,25.08 270 top
TP42  [TP_06]  60.33,23.18 270 top
TP43  [TP_06]  60.33,21.27 270 top
TP44  [TP_06]  60.33,19.37 270 top
TP45  [TP_06]  82.55,39.05 270 top
TP46  [TP_06]  96.68,30.64 270 top
TP47  [TP_06]  58.74,87 90 top
TP48  [TP_06]  46.04,87 90 top
TP49  [TP_06]  33.34,87 90 top
TP50  [TP_06]  20.64,87 90 top
TP51  [TP_06]  59.05,98.42 90 top
TP52  [TP_06]  46.35,98.42 90 top
TP53  [TP_06]  33.66,98.42 90 top
TP54  [TP_06]  20.95,98.42 90 top
TP55  [TP_06]  69.22,98.42 90 top
TP56  [TP_06]  56.52,98.42 90 top
TP57  [TP_06]  43.81,98.42 90 top
TP58  [TP_06]  31.11,98.42 90 top
TP59  [TP_06]  60.33,17.46 270 top
TP60  [TP_06]  9.37,92.71 0 top
TP61  [TP_06]  95.89,86.36 0 top
TP62  [TP_06]  53.34,21.59 0 top
X1  POWER_IN  [W237-132]  95.25,55.24 270 bottom
X2  POWER_OUT  [W237-132]  95.25,45.09 270 bottom
X3  52559-3092  [52559-3092]  4.76,45.09 90 bottom
X4  uUSB  [614105150621]  70.48,47.62 270 top
X5  [USB_C_VERT_THT_8PIN]  73.66,47.62 90 top
Y1  5032/2P  [OSCCC500X320X135]  61.28,56.52 270 top
Y2  3215_2P  [SMD-3215_2P]  60.01,51.28 270 top

## Tracks (layer width: path | path; a pad name or v marks a point on that pad's centre or on a via)
3V3_IN
  Top 0.61: TP4.P$1 20.32,72.39 20.32,69.13 25.67,63.77 27.42,63.77 27.46,63.82
  Top 1.27: D5.C 34.02,64.03
  pour Top (rank 2): 27.3,68.74 32.23,68.74 35.56,65.41 35.56,62.87 27.3,62.87
5V_IN
  pour Top (rank 3): 63.5,62.23 65.41,62.23 66.99,60.64 77.15,60.64 78.11,59.69 78.11,53.34 77.47,52.7 71.44,52.7 71.44,55.88 66.04,55.88 63.5,58.42
!M12_FAULT
  Top 0.152: IC2.8 88.37,74.19 87.31,75.25 83.34,75.25 82.65,74.56 82.65,73.36 80.42,71.12 JP45.1
!M34_FAULT
  Top 0.152: IC5.8 92.92,28.93 93.07,28.78 96.95,28.78 97.16,28.57 JP46.1
+3V3  (via drill 0.3, 0.6)
  Top 0.152: JP26.3 51.44,4.45 52.7,5.71 52.7,10.64 52.23,11.11 R62.1 | R24.2 v32.23,19.37 | R37.2 v36.04,19.37 35.88,19.21 Q5.1 | Q6.1 39.69,19.21 v39.85,19.37 R42.2 | Q7.1 v43.49,19.36 v43.5,19.37 | R51.1 75.56,9.21 75.88,8.89 75.88,8.26 | R57.1 75.88,8.26 | JP13.3 75.88,7.3 75.88,8.26 | LED8.A 87,87.79 86.84,87.95 86.84,89.53 87,89.69 JP3.1 | R50.1 v16.51,33.02
  Top 0.508: JP27.3 31.37,3.56 SJ1.1 35.94,3.56 JP23.1 | JP26.3 51.69,3.56 SJ2.1 56.26,3.56 JP16.1
  Top 1.016: SJ5.1 v13.65,6.35 | SJ3.1 v13.65,2.54
  Layer2-Sig 0.61: v32.23,19.37 v36.04,19.37 v39.85,19.37 v43.5,19.37
  Layer2-Sig 1.016: v81.12,35.88 75.41,35.88 71.6,32.07 69.22,32.07
  Bottom 0.152: LED8.A 87,87.79 86.84,87.95 86.84,89.53 87,89.69 JP3.1
  Bottom 0.61: JP3.7 JP3.5 JP3.3 JP3.1 85.72,89.53 85.72,86.36 | 85.72,86.36 TP10.P$1 | 85.72,86.36 84.81,86.36 83.2,84.75 83.2,73.04 82.55,72.39 82.55,58.9 81.76,58.1 81.76,48.24 80.49,46.97 80.49,43.97 82.23,42.23 82.23,40.04 81.63,39.44 81.63,36.38 v81.12,35.88
  pour Bottom (rank 2): 78.11,0 78.11,6.99 77.15,7.94 73.98,7.94 72.71,6.67 13.49,6.67 12.7,5.87 12.7,0
  pour Layer2-Sig (rank 3): 7.62,39.37 7.62,0 80.01,0 80.01,7.62 69.85,17.78 69.85,33.02 71.75,34.92 71.75,36.83 71.12,37.47 69.22,37.47 60.33,28.57 60.33,20.95 58.42,19.05 48.26,19.05 47.62,19.68 18.41,19.68 17.14,20.95 17.14,35.88 15.88,37.15 11.75,37.15 9.53,39.37
+3V3S  (via drill 0.3, 0.3 pad 0.6, 0.35, 0.6)
  Top 0.152: R78.2 48.41,22.23 | 48.41,22.23 R79.2 | v49.21,22.38 49.05,22.23 48.41,22.23 | v55.24,24.29 v55.23,24.3 C43.2 54.45,23.81 54.15,23.52 IC12.13 | IC12.8 50.69,22.27 50.64,22.23 C42.1 | IC12.9 51.19,21.9 51.03,21.74 C42.1 | C42.1 50.15,21.74 v49.85,21.43 | LED6.A 81.92,87.79 81.76,87.95 81.76,89.53 81.92,89.69 JP2.1 | LED24.A v0.95,67.94 | R154.2 v33.66,60.96 | R155.2 33.34,58.42 33.66,58.1 33.66,57.63 33.34,57.31 31.27,57.31 31.11,57.15 IM3.2 | Q8.1 27.31,41.91 v26.67,41.27 | IC2.1 93.31,72.83 v93.66,73.18 | IC5.1 88.37,28.84 87.47,27.94 v86.36,27.94 | R6.2 87.47,60.33 v87.15,60.64
  Top 0.305: IC13.100 53.94,47.34 54.44,46.84 C50.2 | IC13.50 41.94,63.31 41.45,63.81 C46.2 | C47.2 52.94,64.07 IC13.28 | IC13.11 56.8,54.24 C48.2 | 54.44,45.41 v54.45,45.4 | C28.1 | C29.1 | C30.1 | C31.1 | IC13.22 56.3,59.74 56.53,59.52 | 56.53,59.52 C52.2 | IC13.21 56.25,59.24 56.53,59.52 | IC13.75 39.56,49.24 39.38,49.06 C49.2
  Top 0.406: C48.2 v57.78,54.44 v58.74,54.44 | C50.2 54.44,45.41 | IC8.5 C28.1 | C28.1 58.75,96.83 v58.74,96.84 | D26.2 66.36,92.39 65.88,92.87 v65.88,94.93 | IC9.5 C29.1 | C29.1 46.05,96.83 v46.04,96.84 | D27.2 53.66,92.39 53.18,92.87 v53.18,94.93 | IC10.5 C30.1 | C30.1 33.35,96.83 v33.34,96.84 | D28.2 40.95,92.39 40.48,92.87 v40.48,94.93 | IC11.5 C31.1 | C31.1 20.65,96.83 v20.64,96.84 | D29.2 28.25,92.39 27.78,92.87 v27.78,94.93 | D11.2 D12.2 v81.12,82.87 | D14.2 D13.2 v81.12,79.06 | v79.69,68.74 79.7,68.75 C17.1 81.59,68.75 81.92,68.42 81.92,67.31 82.23,66.99 84.3,66.99 84.61,67.31 IC4.5 | IC3.5 98.58,69.05 99.38,69.85 99.38,71.28 98.57,72.08 C18.1 v98.57,73.33 v98.58,73.34 | D30.2 v62.87,16.51 | IC7.5 96.68,35.72 | C22.1 96.68,35.72 | 96.68,35.72 v96.68,38.1 | IC6.5 C23.1 82.72,37.47 83.51,38.26 83.51,40.02 v84.14,40.64 | C52.2 v57.77,59.52 v57.78,59.53 | C47.2 52.72,65.08 v52.7,65.09 v52.7,65.88 | C46.2 41.43,64.31 v41.43,65.09 | C49.2 38.11,49.06 v38.1,49.05 37.78,49.05 v37.47,49.37 | v62.87,20.32 D20.2 D19.2 | D17.2 D18.2 v62.87,24.13 | v54.45,45.4 v54.45,44.45
  Top 0.61: v57.77,59.52 58.19,59.52 C53.2 58.19,62.15 v58.26,62.23 v58.26,63.02
  Top 0.813: SJ8.1 v81.76,73.66 | SJ9.1 v86.36,27.94 | SJ4.1 12,11.37 12.7,12.06 12.7,13.34
  Top 1.016: SJ4.1 14.61,10.16 JP40.1 | v15.46,18.1 15.46,18.07 12.7,15.31 12.7,13.34
  Layer2-Sig 0.152: v55.24,24.29 53.66,22.7 50.16,22.7 49.85,22.38 | 49.85,22.38 v49.21,22.38 | v49.85,21.43 49.85,22.38 | JP30.5 5.56,76.2 1.11,76.2 0.48,75.56 0.48,68.42 v0.95,67.94 | v33.66,60.96 33.66,57.63 33.34,57.31 31.27,57.31 31.11,57.15 IM3.2 | v93.66,73.18 93.19,73.66 v81.76,73.66 | v87.15,60.64 86.26,60.64 v81.44,65.46
  Layer2-Sig 0.406: v96.68,38.1 94.14,40.64 v84.14,40.64 84.14,46.35 74.61,55.88 61.44,55.88 59.37,57.95 59.37,58.74 v58.58,59.53 | v79.69,68.74 83.34,72.39 84.56,72.39 84.95,71.99 97.23,71.99 v98.58,73.34
  Layer2-Sig 0.61: v57.78,59.53 v58.58,59.53 59.05,60.01 59.05,63.66 59.85,64.45 59.85,68.74 60.48,69.37 v75.25,69.37 v76.04,69.37 76.68,68.74 v79.69,68.74 | v69.85,95.89 v69.85,95.09 69.85,90.33 71.79,88.39 73.34,88.39 77.15,84.58 v77.15,71.12
  Layer2-Sig 0.813: v24.13,69.85 24.13,72.39 19.05,77.47 19.05,88.27 25.72,94.93 v27.78,94.93 v29.84,94.93
  Layer2-Sig 1.016: v86.36,27.94 84.77,26.35 v68.26,26.35 | v81.44,65.46 68,65.46 65.75,63.21 v64.72,63.21
  Layer3-GND 0.61: v37.47,49.37 37.78,49.05 v38.1,49.05 40.8,49.05 42.86,51.12 v42.86,53.5 v42.86,54.29 | v54.45,44.45 v54.45,45.4 58.58,49.53 58.58,54.28 v58.74,54.44 v57.78,54.44
  Bottom 0.152: LED6.A 81.92,87.79 81.76,87.95 81.76,89.53 81.92,89.69 JP2.1 | LED24.A v0.95,67.94
  Bottom 0.406: v81.12,82.87 82.23,82.87 | v81.12,79.06 82.23,79.06
  Bottom 0.61: 8.09,43.34 X3.12 5.39,43.34 4.89,42.84 X3.11 | v20.64,96.84 v33.34,96.84 v46.04,96.84 v58.74,96.84 68.9,96.84 v69.85,95.89 v69.85,95.09 | v27.78,94.93 v40.48,94.93 v53.18,94.93 v65.88,94.93 | v75.25,69.37 v76.04,69.37 77.15,70.48 v77.15,71.12 v77.15,71.91
  Bottom 1.016: JP2.7 JP2.5 JP2.3 JP2.1 80.96,89.85 80.96,87.31 TP9.P$1 82.23,86.04 82.23,82.87 82.23,79.06 82.23,76.94 81.76,76.46 v81.76,73.66 81.44,73.34 v81.44,65.46
  other vias: 41.43,65.88 36.67,71.75 37.47,71.75 38.26,71.75 39.05,71.75 39.05,70.96 39.05,70.17 39.05,69.37 35.88,71.75 35.88,70.17 35.88,70.96 32.86,69.22 32.86,70.01 32.54,70.64 31.75,70.64 30.96,70.64 40.16,65.88 38.58,65.88 39.37,65.88 36.99,65.88 36.2,65.88 39.05,68.58 37.78,65.88 35.88,68.58 35.88,69.37 31.75,56.67 32.54,56.67 33.34,56.67 33.34,55.88 32.54,55.88 31.75,55.88 31.75,54.29 32.54,54.29 33.34,54.29 32.7,50.01 32.7,49.21 32.7,48.42 31.91,48.42 31.11,48.42 31.11,49.21 31.91,49.21 31.91,50.01 31.11,50.01
  pour Top (rank 3): 28.26,63.5 28.26,71.91 41.91,71.91 41.91,63.5
  pour Bottom (rank 2): 30.48,72.39 28.57,70.48 8.89,70.48 7.62,71.75 7.62,76.2 0,76.2 0,52.7 65.41,52.7 65.41,64.77 63.5,66.67 49.53,66.67 43.81,72.39
  cutout Bottom (rank 2): 58.74,59.21 58.9,59.37 58.9,59.69 58.74,59.85 57.63,59.85 57.47,59.69 57.47,59.37 57.63,59.21
  pour Bottom (rank 5): 7.62,52.07 74.3,52.07 74.3,15.88 7.62,15.88
  pour Top: 28.57,58.42 30.48,58.42 31.11,57.78 33.66,57.78 33.66,47.62 30.48,47.62 30.48,50.16 28.57,52.07
  cutout Bottom: 37.02,49.21 37.31,48.9 37.62,48.9 37.94,48.58 38.26,48.58 38.58,48.9 38.58,49.21 38.26,49.53 37.94,49.53 37.62,49.85 37.34,49.85 36.99,49.53 36.99,49.24
  cutout Bottom: 53.18,45.88 53.18,43.97 55.88,43.97 55.88,44.77 54.77,45.88
+5V  (via drill 0.3, 0.6)
  Top 0.152: LED4.A 76.83,87.79 76.68,87.95 76.68,89.53 76.83,89.69 JP5.1
  Top 0.406: D9.C B1.+
  Top 0.813: D8.C 9.41,36.72 10.16,37.47 10.16,40.01 v9.53,40.64 v8.57,40.64 | SJ8.3 v75.25,73.66
  Top 1.016: D8.C 9.41,33.13 B1.+ | D3.C 70.17,60.64 IM1.OUT | v28.89,73.18 D4.A | v33.66,8.1 SJ1.3 | SJ2.3 v53.98,8.1 | SJ3.3 8.89,2.6 v8.89,4.45 8.89,6.29 SJ5.3 8.89,6.41 v8.89,8.26 8.89,10.1 SJ4.3 | D31.A 66.99,33.34 v69.53,30.8 | v81.6,29.84 81.6,28 SJ9.3
  Bottom 0.152: LED4.A 76.83,87.79 76.68,87.95 76.68,89.53 76.83,89.69 JP5.1
  Bottom 0.61: X3.6 6.51,40.34 | X3.5 4.91,39.84 5.41,40.34 X3.6 | v8.57,40.64 8.27,40.34 X3.6
  Bottom 0.813: SJ7.3 11.18,36.45 10.16,37.47 10.16,40.16 9.68,40.64 v9.53,40.64 v8.57,40.64
  other vias: 66.04,83.03 66.04,81.44 67.63,83.03 67.63,81.44 19.37,91.76 17.78,91.76 19.37,90.17 17.78,90.17
  pour Bottom (rank 3): 6.99,40.96 11.11,40.96 13.34,38.73 13.34,18.41 15.88,15.88 67.94,15.88 69.22,17.14 69.22,31.75 74.77,37.31 74.77,45.88 67.63,53.02 57.95,53.18 40.64,70.48 9.21,70.48 8.26,71.44 8.26,100.33 83.19,100.33 83.19,0 7.62,0 7.62,35.56 6.99,36.2
  pour Top (rank 5, no thermals): 62.87,83.5 62.87,80.8 68.58,80.8 68.58,83.5
  pour Top (rank 3, no thermals): 19.84,94.61 19.53,94.93 17.62,94.93 17.3,94.61 17.3,90.01 17.62,89.69 19.53,89.69 19.84,90.01
  cutout Bottom (rank 3): 76.83,88.27 76.83,87.31 77.79,87.31 77.79,88.27
BAT+
  pour Top: 99.69,60.33 90.81,60.33 90.81,52.23 94.46,52.23 94.46,53.82 95.89,55.24 99.69,55.24
BAT+_PROTECTED  (via drill 0.3)
  Top 0.152: R3.2 86.83,59.68 TP2.P$1
  Layer2-Sig 0.61: v92.39,50.16 92.39,54.13 TP2.P$1
  pour Top (no thermals): 91.44,51.59 91.44,48.74 93.34,48.74 93.34,51.59
BOOT0  (via drill 0.3, 0.3 pad 0.6)
  Top 0.152: v50.96,48.74 50.94,48.72 IC13.94 | JP36.2 69.22,40.01 69.22,41.91 68.58,42.55 65.41,42.55 64.93,43.02 62.23,43.02 v61.91,43.34 | R75.1 v18.41,46.2 18.89,46.2 19.69,46.99 Q9.1
  Layer2-Sig 0.152: v4.76,43.81 7.14,43.81 8.41,45.09 17.14,45.09 17.3,45.09 v18.41,46.2 19.37,47.15 25.24,47.15 25.88,46.51 31.11,46.51 32.07,47.47 39.37,47.47 42.7,50.8 47.62,50.8 49.69,48.74 v50.96,48.74 52.55,47.15 59.69,47.15 61.91,44.93 v61.91,43.34 | JP36.2 71.75,37.47 71.75,34.61 TP19.P$1
  Bottom 0.152: v4.76,43.81 4.33,43.81 4.32,43.84 X3.13
BOOT1_PULL-DOWN
  Top 0.152: Q9.3 20.64,50.16 20.8,50.32 21.91,50.32 22.54,49.69 R74.1
BUTTON1  (via drill 0.3)
  Top 0.152: R92.1 26.99,51.45 | 26.99,51.45 27.78,50.65 27.78,49.05 v27.94,48.9 | v49.85,49.53 49.85,49.05 49.94,48.96 IC13.92 | R74.2 25.72,51.45 26.99,51.45
  Layer2-Sig 0.152: v49.85,49.53 48.26,51.12 42.55,51.12 39.21,47.78 30.96,47.78 29.84,48.9 v27.94,48.9
BUTTON2  (via drill 0.3)
  Top 0.152: IC13.84 45.94,48.8 46.51,49.37 46.51,51.44 46.04,51.91 v46.04,58.26 | R94.1 v8.1,68.58
  Layer2-Sig 0.152: v8.1,68.58 8.89,67.79 30,67.79 39.53,58.26 v46.04,58.26
BUTTON3
  Top 0.152: IC13.37 48.42,62.9 R96.1
BUTTON4  (via drill 0.3)
  Top 0.152: IC13.85 46.44,48.82 46.83,49.21 46.83,53.34 v46.67,53.5 | R98.1 v20.32,52.7
  Layer2-Sig 0.152: v20.32,52.7 23.5,52.7 23.97,53.18 37.94,53.18 39.69,54.93 45.24,54.93 v46.67,53.5
BUTTON-1  (via drill 0.3)
  Top 0.152: C13.1 25.2,63.5 S2.1 S2.2 26.99,55.21 R92.2 | v10.16,47.62 10.48,47.94 10.48,48.58 9.84,49.21 9.84,55.56 11.43,57.15 v11.43,60.48
  Layer2-Sig 0.152: v11.43,60.48 24.57,60.48 S2.1
  Bottom 0.152: X3.18 8.87,46.34 v10.16,47.62 | JP42.1 2.86,83.98 2.86,71.8 3.65,71.01 3.65,64.29 7.46,60.48 v11.43,60.48
BUTTON-2  (via drill 0.3)
  Top 0.152: v4.76,46.83 6.37,48.43 6.37,51.24 7.34,52.22 S3.2 7.34,62.23 S3.1 7.34,63.54 8.1,64.29 | R94.2 8.1,64.29 | C12.1 9.37,64.77 8.89,64.29 8.1,64.29
  Bottom 0.152: v4.76,46.83 4.32,46.83 4.32,46.84 X3.19 | JP42.3 3.17,83.98 3.17,71.91 4.92,70.17 4.92,63.46 6.07,62.31 S3.1
BUTTON-3  (via drill 0.3)
  Top 0.152: C11.1 15.67,73.03 S4.1 S4.2 15.6,64.06 12,64.06 10.7,62.76 10.7,56.89 9.53,55.72 9.53,48.74 v9.84,48.42 | R96.2 v48.42,67.47
  Layer2-Sig 0.152: JP42.5 7.94,83.98 7.94,74.3 8.75,73.48 12.24,73.48 13.89,71.83 S4.1 16.87,69.64 17.78,68.72 30.5,68.72 32.07,67.15 48.1,67.15 v48.42,67.47
  Bottom 0.152: v9.84,48.42 8.76,47.34 X3.20
BUTTON-4  (via drill 0.3)
  Top 0.152: S5.2 S5.1 | C10.1 15.67,53.98 S5.1 | S5.1 17.98,52.78 18.05,52.7 R98.2 | v19.05,69.23 v19.05,56.2
  Layer2-Sig 0.152: v4.76,47.78 5.56,46.99 11.51,46.99 11.89,47.37 12.8,47.37 13.17,46.99 16.15,46.99 S5.2 | JP42.7 8.26,83.98 8.26,74.45 8.89,73.82 17.46,73.82 19.05,72.23 v19.05,69.23
  Bottom 0.152: v4.76,47.78 4.37,47.78 4.32,47.84 X3.21 | v19.05,56.2 19.05,54.97 S5.1
BUTTON-OFF  (via drill 0.3, 0.35)
  Top 0.152: S6.2 S6.1 25.2,73.03 C9.1 | v4.76,45.88 6.67,47.78 6.67,51.12 8.57,53.02 8.57,63.18 v8.89,63.5 10.48,65.09 10.48,88.06 9.78,88.76 3.16,88.76 JP44.1 | R100.2 v43.81,67.79
  Layer2-Sig 0.152: v8.89,63.5 24.56,63.5 S6.2 | v43.81,67.79 31.91,67.79 30.64,69.06 29.17,69.06 S6.1
  Bottom 0.152: v4.76,45.88 4.36,45.88 4.32,45.84 X3.17
BUTTON-ON  (via drill 0.3)
  Top 0.152: S1.2 15.55,54.49 11.88,54.49 10.16,52.77 10.16,49.37 10.82,48.71 10.82,47.57 10.16,46.91 v10.16,46.35 | JP44.3 5.39,91.28 9.84,91.28 11.45,89.67 11.45,74.49 12.26,73.67 17.13,73.67 18.41,72.39 18.41,63.86 S1.1 S1.2 | Q3.1 21.27,52.86 18.33,55.8 S1.2 | R3.1 85.89,57.8 v85.88,57.78 86.36,57.31 C5.2
  Layer2-Sig 0.152: S1.2 19.17,53.5 37.78,53.5 39.53,55.24 51.44,55.24 51.59,55.09 v52.55,55.09 | v65.88,56.52 66.52,57.15 66.83,57.15 67.33,56.66 83.49,56.66 84.61,57.78 v85.88,57.78
  Bottom 0.152: v10.16,46.35 9.14,45.34 X3.16 | v52.55,55.09 57.2,55.09 57.52,55.4 65.56,55.4 65.88,55.72 v65.88,56.52
BUTTON-ON-LV
  Top 0.152: R5.2 22.54,50.64 22.23,50.96 Q3.3
BUTTON_OFF
  Top 0.152: IC13.46 43.94,63.69 43.81,63.82 R100.1
BUTTON_ON  (via drill 0.3)
  Top 0.152: v24.77,52.23 24.77,50.96 24.45,50.64 R5.1 | IC13.66 39.56,53.74 39.27,53.46 39.01,53.46 v38.42,52.86
  Layer2-Sig 0.152: v38.42,52.86 25.4,52.86 v24.77,52.23
BUZZER
  Top 0.152: IC13.88 R108.1
BUZZER-
  Top 0.406: D9.A B1.- Q10.3
BUZZER-GATE  (via drill 0.3)
  Top 0.152: Q10.1 R109.1 7.47,22.53 7.14,22.86 7.14,35.88 v4.76,38.26 | R108.2 47.94,44.14 48.1,43.98 v48.1,43.02
  Layer2-Sig 0.152: v48.1,43.02 47.47,42.39 32.86,42.39 TP21.P$1 29.84,39.37 7.62,39.37 6.51,38.26 v4.76,38.26
  Bottom 0.152: X3.3 4.19,38.84 v4.76,38.26
CPOUT
  Top 0.152: C45.2 52.39,27.78 52.19,27.58 IC12.20
DEBUG-RX
  Top 0.152: R72.2 60.01,43.19 61.59,41.6 61.59,40.01 JP35.3
DEBUG-TX
  Top 0.152: R73.2 59.05,40.01 JP35.4
  Bottom 0.152: SJ6.1 59.31,39.75 JP35.4
DEBUG_RX  (via drill 0.3)
  Top 0.152: R72.1 60.01,45.72 v59.69,46.04 | IC13.69 41.73,52.24 v43.81,50.16
  Layer2-Sig 0.152: v59.69,46.04 59.53,45.88 58.9,45.88 58.42,46.35 47.94,46.35 46.99,47.31 46.67,47.31 v43.81,50.16
DEBUG_TX  (via drill 0.3)
  Top 0.152: R73.1 v59.05,46.51 | IC13.68 42.35,52.74 44.61,50.48 v44.61,50.16
  Layer2-Sig 0.152: v44.61,50.16 44.61,50.12 48.05,46.67 58.9,46.67 v59.05,46.51
ENC1A  (via drill 0.3)
  Top 0.152: IC13.77 42.44,48.32 42.7,48.58 45.24,48.58 46.2,49.53 46.2,51.28 45.4,52.07 45.4,58.42 46.83,59.85 52.86,59.85 v54.29,61.28 | R115.1 82.88,83.98 82.72,83.82 D12.3 TP28.P$1
  Layer2-Sig 0.152: v54.29,61.28 54.29,62.39 57.47,65.56 57.47,76.52 59.05,78.11 69.53,78.11 TP28.P$1
ENC1B-SWO  (via drill 0.3)
  Top 0.152: R69.2 48.9,43.5 49.85,42.55 v54.13,42.55
  Bottom 0.152: SJ6.3 54.39,42.8 v54.13,42.55
ENC1B/SWO  (via drill 0.3)
  Top 0.152: R69.1 48.9,46.2 48.44,46.65 IC13.89 48.44,57.81 50.16,59.53 53.34,59.53 v54.29,60.48 | R114.1 D11.3 TP27.P$1
  Layer2-Sig 0.152: v54.29,60.48 54.93,61.12 54.93,62.55 57.78,65.41 57.78,76.2 59.39,77.8 69.71,77.8 73.82,81.92 TP27.P$1
ENC2A  (via drill 0.3)
  Top 0.152: R117.1 82.7,79.06 81.83,78.19 81.75,78.11 D14.3 TP30.P$1 | v53.66,59.05 50.16,59.05 48.94,57.83 IC13.90
  Layer2-Sig 0.152: v53.66,59.05 53.79,59.18 54.5,59.18 55.56,60.24 55.56,62.23 58.42,65.09 58.42,75.56 60.01,77.15 70.01,77.15 70.96,78.11 TP30.P$1
ENC2B  (via drill 0.3)
  Top 0.152: R116.1 D13.3 TP29.P$1 | IC13.91 49.44,48.51 49.24,48.7 49.24,57.66 50.01,58.42 53.98,58.42 54.29,58.74 v54.29,59.69
  Layer2-Sig 0.152: v54.29,59.69 55.24,60.64 55.24,62.39 58.1,65.25 58.1,75.88 59.72,77.5 69.88,77.5 72.39,80.01 TP29.P$1
ENC3A  (via drill 0.3)
  Top 0.152: IC13.59 36.29,57.24 35.56,56.52 35.56,48.9 38.1,46.35 38.1,43.61 38.26,43.45 38.26,40.64 39.21,39.69 39.69,39.69 40.64,38.73 v40.64,29.21 | TP41.P$1 D17.3 R120.1
  Layer2-Sig 0.152: v40.64,29.21 56.2,29.21 TP41.P$1
ENC3B  (via drill 0.3)
  Top 0.152: IC13.60 38.43,56.74 38.31,56.86 36.38,56.86 35.88,56.36 35.88,49.05 38.42,46.51 38.42,43.81 40.45,41.79 40.45,39.41 40.96,38.89 40.96,32.86 41.27,32.54 v41.27,28.57 | TP42.P$1 D18.3 R121.1
  Layer2-Sig 0.152: v41.27,28.57 54.93,28.57 TP42.P$1
ENC4A  (via drill 0.3)
  Top 0.152: IC13.63 36.83,55.24 36.2,54.61 36.2,49.21 38.73,46.67 38.73,43.97 40.75,41.96 40.75,40.91 42.86,38.8 42.86,36.2 41.91,35.24 v41.91,27.94 | R122.1 D19.3 TP43.P$1
  Layer2-Sig 0.152: v41.91,27.94 55.09,27.94 59.37,23.65 59.37,22.23 TP43.P$1
ENC4B  (via drill 0.3)
  Top 0.152: IC13.64 36.97,54.74 36.51,54.29 36.51,49.37 39.05,46.83 39.05,44.13 40.8,42.39 42.32,42.39 42.99,41.72 42.99,39.25 43.18,39.05 43.18,36.04 42.23,35.08 42.23,28.57 42.55,28.26 v42.55,27.3 | R123.1 D20.3 TP44.P$1
  Layer2-Sig 0.152: v42.55,27.3 55.24,27.3 59.05,23.5 59.05,20.64 TP44.P$1
ENC12_PWR
  Top 0.813: D10.A 79.38,76.36 78.74,75.72 SJ8.2
ENC12PWR  (via drill 0.6)
  Top 0.813: D10.C 83.98,76.36 v85.09,77.47
  Bottom 0.813: v85.09,77.47 85.09,78.09 86.06,79.06 88.74,79.06 | P2.5 93.17,79.06 88.74,79.06 | 88.74,79.06 88.76,79.07 P1.5 88.78,83.82 90.18,85.22 92.2,85.22 TP22.P$1
ENC34_PWR
  Top 0.813: SJ9.2 D15.A
ENC34PWR
  Top 0.813: D15.C TP33.P$1
  Bottom 0.61: 88.76,20.95 89.53,20.95
  Bottom 0.813: TP33.P$1 88.76,20.95 P3.5 | 89.53,20.95 92.22,20.95 P4.5
ENC_1A
  Top 0.152: R115.2 84.93,83.98 86.2,85.25 91.33,85.25 P1.3
ENC_1B
  Top 0.152: R114.2 84.77,81.92 85.69,82.84 85.69,84.26 86.36,84.93 89.65,84.93 P1.4
ENC_2A
  Top 0.152: R117.2 85.57,79.06 86.04,79.53 88.69,79.53 P2.3
ENC_2B
  Top 0.152: R116.2 90.22,80.01 P2.4
ENC_3A  (via drill 0.3)
  Top 0.152: R120.2 v70.48,25.08
  Layer2-Sig 0.152: P3.4 89.47,23.48 72.09,23.48 v70.48,25.08
ENC_3B  (via drill 0.3)
  Top 0.152: R121.2 v70.48,23.18
  Layer2-Sig 0.152: P3.3 91.17,23.18 v70.48,23.18
ENC_4A  (via drill 0.3)
  Top 0.152: R122.2 v70.48,21.27
  Layer2-Sig 0.152: v70.48,21.27 71.28,22.07 89.11,22.07 P4.4
ENC_4B  (via drill 0.3)
  Top 0.152: R123.2 v70.48,19.37
  Layer2-Sig 0.152: v70.48,19.37 72.87,21.75 87.42,21.75 P4.3
ESP-EN  (via drill 0.3)
  Top 0.152: S7.1 S7.2 | v37.15,54.13 37.31,53.98 R107.2 | 8.89,44.45 8.89,56.36 v9.53,56.99 9.53,62.87 10.79,64.14 10.79,88.27 10,89.06 7.94,89.06 JP44.5 | 8.89,44.45 5.71,44.45 5.4,44.77 v4.76,44.77 | IM9.2 11.43,39.63 8.89,42.17 8.89,44.45
  Layer2-Sig 0.152: v9.53,56.99 27.15,56.99 28.42,55.72 30.64,55.72 31.43,54.93 36.35,54.93 v37.15,54.13 | TP60.P$1 JP44.5 | IM9.2 10.48,39.05 7.78,39.05 7.18,38.46 7.18,15.79 S7.1
  Bottom 0.152: X3.15 4.38,44.84 4.45,44.77 v4.76,44.77
ESP-I2C-PWR
  Top 0.152: JP10.1 36.2,9.84 37.78,11.43 37.78,13.81 37.29,14.3 33.05,14.3 31.59,15.77 31.59,20.4 32.15,20.95 34.92,20.95 | R43.2 42.55,20.8 42.39,20.95 38.73,20.95 | 34.92,20.95 38.73,20.95 | R38.2 38.73,20.95 | R25.2 34.92,20.95
  Top 1.016: SJ1.2 34.92,5.08 JP15.1
  pour Layer2-Sig (rank 2): 34.92,5.71 34.92,9.53 35.56,10.16 52.07,10.16 52.7,9.53 52.7,5.71 52.07,5.08 35.56,5.08
ESP-I2C-SCL  (via drill 0.3)
  Top 0.152: JP28.3 JP23.3 40.01,5.08 40.01,9.53 38.1,11.43 38.1,13.97 37.47,14.61 35.08,14.61 33.98,15.71 Q5.2 33.98,18.89 33.96,18.9 R24.1 33.96,19.86 v33.5,20.32 | JP57.3 25.4,50.16 20.16,44.93 20.16,22.07 v18.41,20.32 18.41,18.41 16.18,16.18 14.61,16.18 13.97,15.55 R32.2
  Layer2-Sig 0.152: v4.76,49.85 8.17,49.85 8.33,49.69 24.92,49.69 25.4,50.16 JP57.3 | v33.5,20.32 v18.41,20.32
  Bottom 0.152: v4.76,49.85 4.33,49.85 4.32,49.84 X3.25
ESP-I2C-SCL-VSEL
  Top 0.152: JP15.3 JP10.3 38.42,11.75 38.42,14.13 37.62,14.92 35.42,14.92 34.92,15.41 Q5.3 R25.1
ESP-I2C-SDA  (via drill 0.3)
  Top 0.152: JP28.4 JP23.4 42.55,5.08 42.55,9.53 41.91,10.16 41.27,10.16 40.32,11.11 40.32,13.19 37.78,15.72 Q6.2 37.78,18.89 37.77,18.9 R37.1 37.77,19.86 v37.31,20.32 | R41.2 v21.59,20.95 23.02,22.38 23.02,45.09 25.56,47.62 JP57.1
  Layer2-Sig 0.152: v7.94,49.21 8.1,49.37 24.84,49.37 26.59,47.62 JP57.1 | v37.31,20.32 36.67,20.95 v21.59,20.95
  Bottom 0.152: X3.24 7.18,49.34 7.3,49.21 v7.94,49.21
ESP-I2C-SDA-VSEL
  Top 0.152: JP15.4 JP10.4 43.61,8.89 42.03,10.46 41.45,10.46 40.64,11.27 40.64,13.3 38.73,15.2 Q6.3 R38.1
ESP-SPI-!CS1
  Top 0.152: JP9.6 67.94,7.62 R34.2
ESP-SPI-!CS2
  Top 0.152: JP16.6 70.34,4.94 70.34,6.99 69.71,7.62 69.37,7.62 69.22,7.78 R44.2
ESP-SPI-!CS3
  Top 0.152: R54.2 70.48,7.31 70.64,7.16 70.64,2.7 JP22.6
ESP-SPI-MISO
  Top 0.152: R30.2 JP9.4 JP16.4 JP22.4
ESP-SPI-MOSI
  Top 0.152: R27.2 JP9.3 JP16.3 JP22.3
ESP-SPI-SCK
  Top 0.152: R33.2 JP9.5 JP16.5 JP22.5
ESP-UART-RX
  Top 0.152: R87.2 22.86,10.79 23.5,10.16 JP40.4
ESP-UART-TX
  Top 0.152: R86.2 19.05,10.79 JP40.3
ESP-USART-RX
  Top 0.152: JP7.3 22.23,2.54 24.13,2.54 24.77,3.17 24.77,4.45 26.67,6.35 30.32,6.35 33.02,9.05 R28.2
ESP-USART-TX
  Top 0.152: JP7.4 24.77,2.54 26.67,2.54 27.3,3.17 27.3,5.08 27.94,5.71 30.8,5.71 32.38,7.3 32.38,7.94 33.34,8.89 33.97,8.89 34.29,9.21 R31.2
ESP_+5V  (via drill 0.6, 0.6 pad 0.6)
  Top 0.152: LED12.A 96.36,87.79 95.89,87.31 TP61.P$1
  Top 0.813: C41.2 IM9.19
  Top 1.016: D31.C v59.69,33.34 | D6.C v64.14,44.13
  Layer2-Sig 0.61: v64.14,44.13 65.09,45.09 69.37,45.09 69.69,45.4 72.23,45.4 73.03,44.61 81.28,44.61 v81.6,44.29
  Bottom 0.152: LED12.A 96.36,87.79 95.89,87.31 TP61.P$1
  Bottom 0.61: TP61.P$1 97.16,86.36 98.42,85.09 98.42,76.2 97.79,75.56 86.48,75.56 85.15,74.23 85.15,68.2 84.3,67.34 84.3,57.98 83.31,56.99 83.31,45.69 81.92,44.29 v81.6,44.29
  pour Bottom (rank 4): 62.23,44.45 62.23,41.27 60.96,40.01 53.98,40.01 53.98,32.38 60.96,32.38 70.48,41.91 70.48,43.18 68.58,45.09 62.87,45.09
ESP_COM_RX
  Top 0.152: 43.44,45.88 IC13.79 | R83.1 44.13,45.56 43.81,45.88 43.44,45.88 | R145.2 45.4,35.88 45.23,36.05 45.23,36.97 45.72,37.47 45.72,38.73 44.23,40.23 44.23,41.97 43.44,42.76 43.44,45.88
ESP_COM_TX
  Top 0.152: 42.94,45.88 IC13.78 | R82.1 42.23,45.56 42.55,45.88 42.94,45.88 | R146.2 44.45,36.67 45.36,37.58 45.36,38.62 43.92,40.05 43.92,41.85 42.94,42.83 42.94,45.88
ESP_EN
  Top 0.152: IC13.65 39.63,54.24 39.36,53.98 R107.1
ESP_PROG_RX  (via drill 0.3)
  Top 0.152: IC13.83 45.44,46.79 v45.88,46.35 | R147.2 16.51,15.71 20.46,19.66 20.46,44.44 v22.23,46.2
  Layer2-Sig 0.152: v45.88,46.35 44.61,46.35 44.21,45.96 43.74,45.96 43.01,46.69 32.24,46.69 31.43,45.88 23.34,45.88 23.02,46.2 v22.23,46.2
ESP_PROG_TX  (via drill 0.3)
  Top 0.152: IC13.80 43.94,46.86 43.97,46.83 v43.97,46.51 | v23.5,46.51 22.7,45.72 22.7,22.62 21.8,21.72 21.64,21.72 20.95,21.04 20.95,17.61 19.05,15.71 R148.2
  Layer2-Sig 0.152: v43.97,46.51 43.34,47.15 32.23,47.15 31.27,46.2 25.4,46.2 25.08,46.51 v23.5,46.51
ESP_SPI_PWR
  Top 1.016: SJ2.2 55.24,5.08 JP9.1
ESP_UCOM_PWR
  Top 1.016: SJ5.2 10.48,5.08 11.11,4.45 15.24,4.45 JP25.1
ESP_USART_PWR
  Top 1.016: SJ3.2 10.48,1.54 11.11,0.91 15.51,0.91 JP7.1
EXPANDER-COM-DIR  (via drill 0.35)
  Top 0.152: R84.2 v32.38,44.13 | JP41.5 JP39.5
  Layer2-Sig 0.152: v32.38,44.13 31.91,43.66 26.19,43.66 24.92,44.93 22.7,44.93 JP41.5
EXPANDER-COM-INT  (via drill 0.35)
  Top 0.152: JP41.6 JP39.6 | v35.24,43.81 R85.2
  Layer2-Sig 0.152: v35.24,43.81 34.77,43.34 25.56,43.34 25.08,43.81 JP41.6
EXPANDER-UART-RX  (via drill 0.3)
  Top 0.152: R83.2 v44.13,43.02
  Layer2-Sig 0.152: v44.13,43.02 43.81,42.7 25.35,42.7 25.05,42.4 20.18,42.4 19.13,41.35 19.13,41.2 JP39.4
EXPANDER-UART-TX  (via drill 0.3)
  Top 0.152: R82.2 v42.23,43.34
  Layer2-Sig 0.152: v42.23,43.34 41.91,43.02 25.24,43.02 24.92,42.7 17.94,42.7 JP39.3
EXPANDER_COM_PWR
  Top 0.813: D8.A 13.45,36.67 12.7,37.42 12.7,40.01 JP39.1 JP41.1
  Layer2-Sig 0.61: JP39.1 10.16,41.27 10,41.43 8.02,41.43 7.77,41.17 6.88,41.17 5.56,39.85 4.6,39.85 3.81,39.05 3.81,37.78 TP20.P$1
  Bottom 0.813: JP39.1 12.7,40.01 SJ7.2
EXPANDER_RX
  Top 0.152: R146.1 44.45,32.71 43.81,32.08 43.81,20.16 44.13,19.84 44.13,14.92 IM9.25
EXPANDER_TX
  Top 0.152: R145.1 45.4,32.7 44.12,31.42 44.12,20.34 44.45,20 IM9.24
GND  (via drill 0.3, 0.3 pad 0.6, 0.35, 0.6, 0.6 pad 0.3, 0.6 pad 0.6)